# EAGLE design julia_v2 (EAGLE 9.6.2)

## Sheet 1 of 2
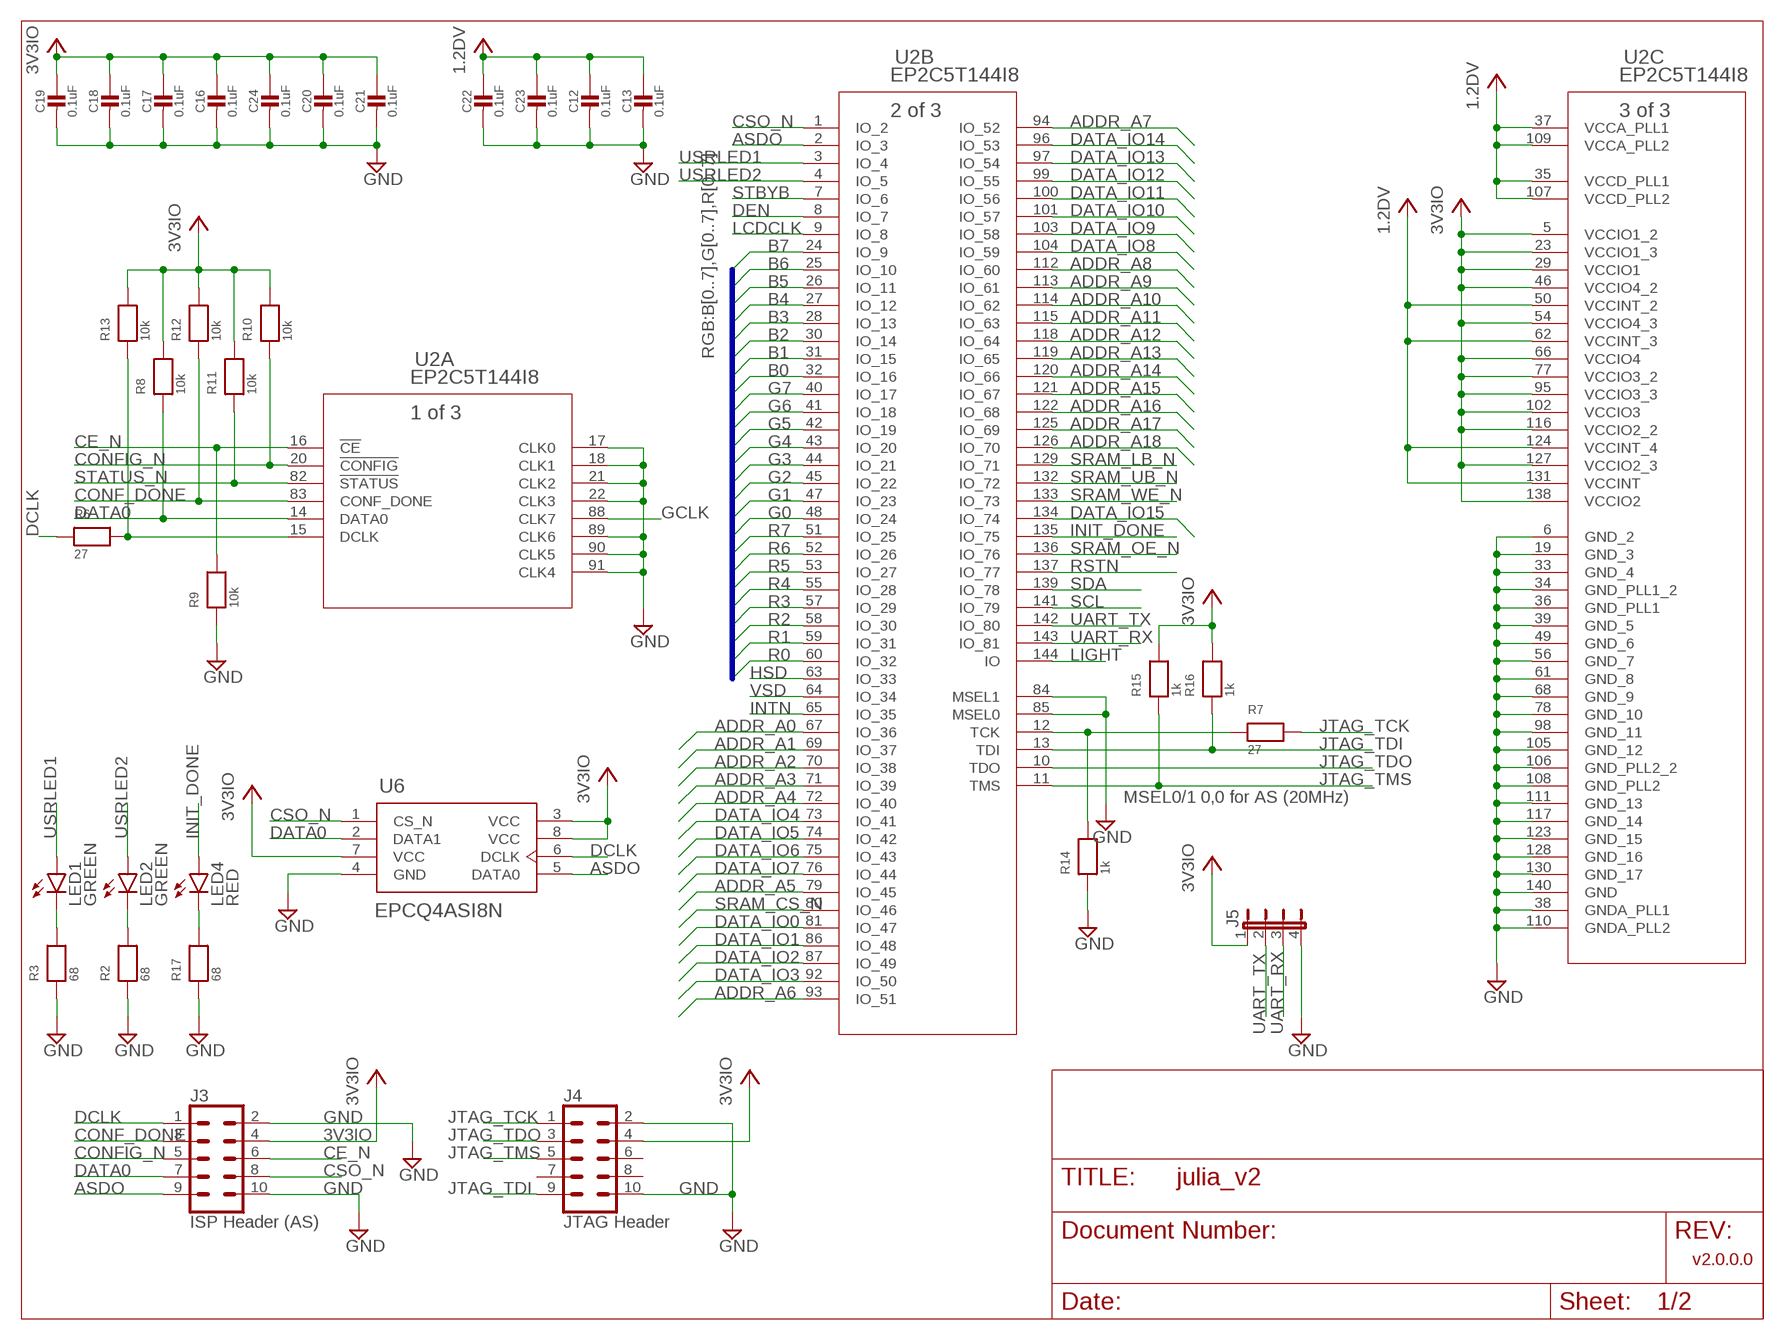
[diagram p0: schematic, sheet 1]

### Parts
C12  0.1uF  CAP_CERAMIC0805  [0805]
C13  0.1uF  CAP_CERAMIC0805  [0805]
C16  0.1uF  CAP_CERAMIC0805  [0805]
C17  0.1uF  CAP_CERAMIC0805  [0805]
C18  0.1uF  CAP_CERAMIC0805  [0805]
C19  0.1uF  CAP_CERAMIC0805  [0805]
C20  0.1uF  CAP_CERAMIC0805  [0805]
C21  0.1uF  CAP_CERAMIC0805  [0805]
C22  0.1uF  CAP_CERAMIC0805  [0805]
C23  0.1uF  CAP_CERAMIC0805  [0805]
C24  0.1uF  CAP_CERAMIC0805  [0805]
J3  ISP Header (AS)  CONN_05X2SHD  [2X5-SHROUDED]
J4  JTAG Header  CONN_05X2SHD  [2X5-SHROUDED]
J5  JP4E  [JP4]
LED1  GREEN  LEDCHIPLED_0805  [CHIPLED_0805]
LED2  GREEN  LEDCHIPLED_0805  [CHIPLED_0805]
LED4  RED  LEDCHIPLED_0805  [CHIPLED_0805]
R2  68  RESISTOR0805  [0805]
R3  68  RESISTOR0805  [0805]
R6  27  RESISTOR0805  [0805]
R7  27  RESISTOR0805  [0805]
R8  10k  RESISTOR0805  [0805]
R9  10k  RESISTOR0805  [0805]
R10  10k  RESISTOR0805  [0805]
R11  10k  RESISTOR0805  [0805]
R12  10k  RESISTOR0805  [0805]
R13  10k  RESISTOR0805  [0805]
R14  1k  RESISTOR0805  [0805]
R15  1k  RESISTOR0805  [0805]
R16  1k  RESISTOR0805  [0805]
R17  68  RESISTOR0805  [0805]
U2  EP2C5T144I8  [144-TQFP_ALR]
U6  EPCQ4ASI8N  [8SOIC]

### Nets
1.2DV: C12.1 C13.1 C22.1 C23.1 U2.35(C:VCCD_PLL1) U2.37(C:VCCA_PLL1) U2.50(C:VCCINT_2) U2.62(C:VCCINT_3) U2.107(C:VCCD_PLL2) U2.109(C:VCCA_PLL2) U2.124(C:VCCINT_4) U2.131(C:VCCINT) ; also sheet 2
3V3IO: C16.1 C17.1 C18.1 C19.1 C20.1 C21.1 C24.1 J3.4 J4.4 J5.1 R8.2 R10.2 R11.2 R12.2 R13.2 R15.2 R16.2 U2.5(C:VCCIO1_2) U2.23(C:VCCIO1_3) U2.29(C:VCCIO1) U2.46(C:VCCIO4_2) U2.54(C:VCCIO4_3) U2.66(C:VCCIO4) U2.77(C:VCCIO3_2) U2.95(C:VCCIO3_3) U2.102(C:VCCIO3) U2.116(C:VCCIO2_2) U2.127(C:VCCIO2_3) U2.138(C:VCCIO2) U6.3(VCC) U6.7(VCC) U6.8(VCC) ; also sheet 2
ADDR_A0: U2.67(B:IO_36) ; also sheet 2
ADDR_A1: U2.69(B:IO_37) ; also sheet 2
ADDR_A2: U2.70(B:IO_38) ; also sheet 2
ADDR_A3: U2.71(B:IO_39) ; also sheet 2
ADDR_A4: U2.72(B:IO_40) ; also sheet 2
ADDR_A5: U2.79(B:IO_45) ; also sheet 2
ADDR_A6: U2.93(B:IO_51) ; also sheet 2
ADDR_A7: U2.94(B:IO_52) ; also sheet 2
ADDR_A8: U2.112(B:IO_60) ; also sheet 2
ADDR_A9: U2.113(B:IO_61) ; also sheet 2
ADDR_A10: U2.114(B:IO_62) ; also sheet 2
ADDR_A11: U2.115(B:IO_63) ; also sheet 2
ADDR_A12: U2.118(B:IO_64) ; also sheet 2
ADDR_A13: U2.119(B:IO_65) ; also sheet 2
ADDR_A14: U2.120(B:IO_66) ; also sheet 2
ADDR_A15: U2.121(B:IO_67) ; also sheet 2
ADDR_A16: U2.122(B:IO_68) ; also sheet 2
ADDR_A17: U2.125(B:IO_69) ; also sheet 2
ADDR_A18: U2.126(B:IO_70) ; also sheet 2
ASDO: J3.9 U2.2(B:IO_3) U6.5(DATA0)
B0: U2.32(B:IO_16) ; also sheet 2
B1: U2.31(B:IO_15) ; also sheet 2
B2: U2.30(B:IO_14) ; also sheet 2
B3: U2.28(B:IO_13) ; also sheet 2
B4: U2.27(B:IO_12) ; also sheet 2
B5: U2.26(B:IO_11) ; also sheet 2
B6: U2.25(B:IO_10) ; also sheet 2
B7: U2.24(B:IO_9) ; also sheet 2
CE_N: J3.6 R9.2 U2.16(A:!CE)
CONF_DONE: J3.3 R12.1 U2.83(A:CONF_DONE)
CONFIG_N: J3.5 R10.1 U2.20(A:!CONFIG)
CSO_N: J3.8 U2.1(B:IO_2) U6.1(CS_N)
DATA0: J3.7 R8.1 U2.14(A:DATA0) U6.2(DATA1)
DATA_IO0: U2.81(B:IO_47) ; also sheet 2
DATA_IO1: U2.86(B:IO_48) ; also sheet 2
DATA_IO2: U2.87(B:IO_49) ; also sheet 2
DATA_IO3: U2.92(B:IO_50) ; also sheet 2
DATA_IO4: U2.73(B:IO_41) ; also sheet 2
DATA_IO5: U2.74(B:IO_42) ; also sheet 2
DATA_IO6: U2.75(B:IO_43) ; also sheet 2
DATA_IO7: U2.76(B:IO_44) ; also sheet 2
DATA_IO8: U2.104(B:IO_59) ; also sheet 2
DATA_IO9: U2.103(B:IO_58) ; also sheet 2
DATA_IO10: U2.101(B:IO_57) ; also sheet 2
DATA_IO11: U2.100(B:IO_56) ; also sheet 2
DATA_IO12: U2.99(B:IO_55) ; also sheet 2
DATA_IO13: U2.97(B:IO_54) ; also sheet 2
DATA_IO14: U2.96(B:IO_53) ; also sheet 2
DATA_IO15: U2.134(B:IO_74) ; also sheet 2
DCLK: J3.1 R6.1 U6.6(DCLK)
DEN: U2.8(B:IO_7) ; also sheet 2
G0: U2.48(B:IO_24) ; also sheet 2
G1: U2.47(B:IO_23) ; also sheet 2
G2: U2.45(B:IO_22) ; also sheet 2
G3: U2.44(B:IO_21) ; also sheet 2
G4: U2.43(B:IO_20) ; also sheet 2
G5: U2.42(B:IO_19) ; also sheet 2
G6: U2.41(B:IO_18) ; also sheet 2
G7: U2.40(B:IO_17) ; also sheet 2
GCLK: U2.88(A:CLK7) ; also sheet 2
GND: C12.2 C13.2 C16.2 C17.2 C18.2 C19.2 C20.2 C21.2 C22.2 C23.2 C24.2 J3.2 J3.10 J4.2 J4.10 J5.4 R2.1 R3.1 R9.1 R14.1 R17.1 U2.6(C:GND_2) U2.17(A:CLK0) U2.18(A:CLK1) U2.19(C:GND_3) U2.21(A:CLK2) U2.22(A:CLK3) U2.33(C:GND_4) U2.34(C:GND_PLL1_2) U2.36(C:GND_PLL1) U2.38(C:GNDA_PLL1) U2.39(C:GND_5) U2.49(C:GND_6) U2.56(C:GND_7) U2.61(C:GND_8) U2.68(C:GND_9) U2.78(C:GND_10) U2.84(B:MSEL1) U2.85(B:MSEL0) U2.89(A:CLK6) U2.90(A:CLK5) U2.91(A:CLK4) U2.98(C:GND_11) U2.105(C:GND_12) U2.106(C:GND_PLL2_2) U2.108(C:GND_PLL2) U2.110(C:GNDA_PLL2) U2.111(C:GND_13) U2.117(C:GND_14) U2.123(C:GND_15) U2.128(C:GND_16) U2.130(C:GND_17) U2.140(C:GND) U6.4(GND) ; also sheet 2
HSD: U2.63(B:IO_33) ; also sheet 2
INIT_DONE: LED4.A U2.135(B:IO_75)
INTN: U2.65(B:IO_35) ; also sheet 2
JTAG_TCK: J4.1 R7.2
JTAG_TDI: J4.9 R16.1 U2.13(B:TDI)
JTAG_TDO: J4.3 U2.10(B:TDO)
JTAG_TMS: J4.5 R15.1 U2.11(B:TMS)
LCDCLK: U2.9(B:IO_8) ; also sheet 2
LIGHT: U2.144(B:IO) ; also sheet 2
N$7: R6.2 R13.1 U2.15(A:DCLK)
N$9: LED1.C R3.2
N$10: R7.1 R14.2 U2.12(B:TCK)
N$12: LED4.C R17.2
N$13: LED2.C R2.2
R0: U2.60(B:IO_32) ; also sheet 2
R1: U2.59(B:IO_31) ; also sheet 2
R2: U2.58(B:IO_30) ; also sheet 2
R3: U2.57(B:IO_29) ; also sheet 2
R4: U2.55(B:IO_28) ; also sheet 2
R5: U2.53(B:IO_27) ; also sheet 2
R6: U2.52(B:IO_26) ; also sheet 2
R7: U2.51(B:IO_25) ; also sheet 2
RSTN: U2.137(B:IO_77) ; also sheet 2
SCL: U2.141(B:IO_79) ; also sheet 2
SDA: U2.139(B:IO_78) ; also sheet 2
SRAM_CS_N: U2.80(B:IO_46) ; also sheet 2
SRAM_LB_N: U2.129(B:IO_71) ; also sheet 2
SRAM_OE_N: U2.136(B:IO_76) ; also sheet 2
SRAM_UB_N: U2.132(B:IO_72) ; also sheet 2
SRAM_WE_N: U2.133(B:IO_73) ; also sheet 2
STATUS_N: R11.1 U2.82(A:!STATUS) ; also sheet 2
STBYB: U2.7(B:IO_6) ; also sheet 2
UART_RX: J5.3 U2.143(B:IO_81)
UART_TX: J5.2 U2.142(B:IO_80)
USRLED1: LED1.A U2.3(B:IO_4)
USRLED2: LED2.A U2.4(B:IO_5)
VSD: U2.64(B:IO_34) ; also sheet 2
Unconnected: J4.6 J4.7 J4.8

### Buses
RGB:B[0..7],G[0..7],R[0..7]

### Notes on the sheet
- MSEL0/1 0,0 for AS (20MHz)
- v2.0.0.0

## Sheet 2 of 2
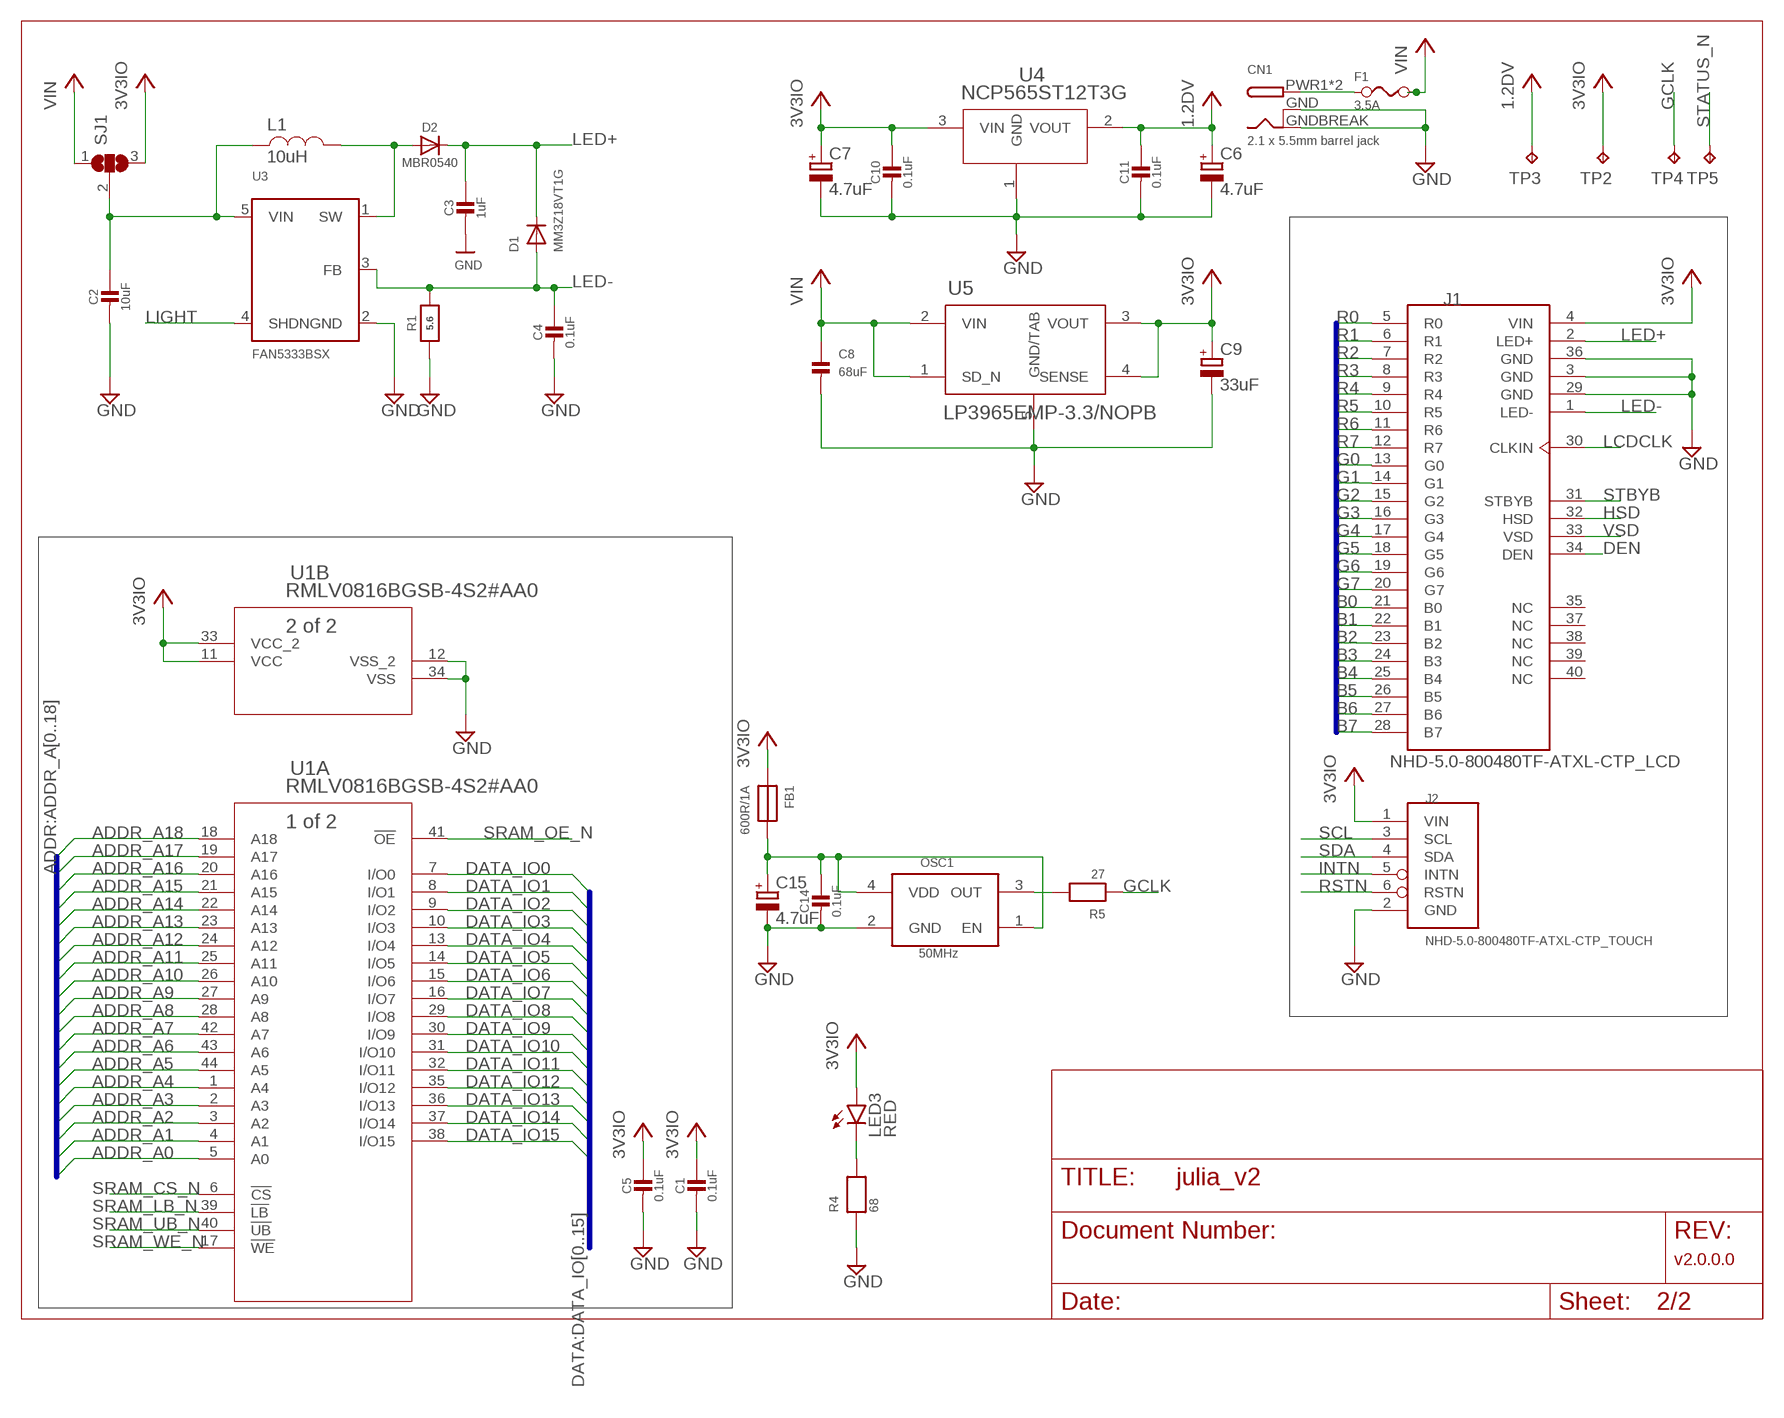
[diagram p1: schematic, sheet 2]

### Parts
C1  0.1uF  CAP_CERAMIC0805  [0805]
C2  10uF  CAP_CERAMIC0805  [0805]
C3  1uF  CAP_CERAMIC0805  [0805]
C4  0.1uF  CAP_CERAMIC0805  [0805]
C5  0.1uF  CAP_CERAMIC0805  [0805]
C6  4.7uF  CPOL  [CPOL0805]
C7  4.7uF  CPOL  [CPOL0805]
C8  68uF  CAP_CERAMIC1206  [1206]
C9  33uF  CPOL  [CPOL0805]
C10  0.1uF  CAP_CERAMIC0805  [0805]
C11  0.1uF  CAP_CERAMIC0805  [0805]
C14  0.1uF  CAP_CERAMIC0805  [0805]
C15  4.7uF  CPOL  [CPOL0805]
CN1  DCBARRELSMT  [DCJACK_2MM_SMT]
D1  MM3Z18VT1G  DIODE-SOD323  [SOD-323]
D2  MBR0540  DIODESOD-123  [SOD-123]
F1  3.5A  FUSE12061206  [1206]
FB1  600R/1A  FERRITE  [0603]
J1  NHD-5.0-800480TF-ATXL-CTP_LCD  [54132-4097]
J2  NHD-5.0-800480TF-ATXL-CTP_TOUCH  [52271-0679]
L1  10uH  SPM10040T-100M-HZ  [SPM10040T-100M-HZ]
LED3  RED  LEDCHIPLED_0805  [CHIPLED_0805]
OSC1  50MHz  ASV-50.000MHZ-EJ-T  [CRYSTALASV]
R1  5.6  RESISTOR0805  [0805]
R4  68  RESISTOR0805  [0805]
R5  27  RESISTOR0805  [0805]
SJ1  SJ2WW  [SJ_2W]
TP2  TPB1,27  [B1,27]
TP3  TPB1,27  [B1,27]
TP4  TPB1,27  [B1,27]
TP5  TPB1,27  [B1,27]
U1  RMLV0816BGSB-4S2#AA0  [PTSB0044GG-A_REN]
U3  FAN5333BSX  FAN5331  [SOT23-5@1]
U4  NCP565ST12T3G  [SOT223-3_ONS]
U5  LP3965EMP-3.3/NOPB  [NDC0005A]

### Nets
1.2DV: C6.1(+) C11.1 TP3.TP U4.2(VOUT) ; also sheet 1
3V3IO: C1.1 C5.1 C7.1(+) C9.1(+) C10.1 FB1.1 J1.4(VIN) J2.1(VIN) LED3.A SJ1.3 TP2.TP U1.11(B:VCC) U1.33(B:VCC_2) U4.3(VIN) U5.3(VOUT) U5.4(SENSE) ; also sheet 1
_GCLK: OSC1.3(OUT) R5.2
ADDR_A0: U1.5(A:A0) ; also sheet 1
ADDR_A1: U1.4(A:A1) ; also sheet 1
ADDR_A2: U1.3(A:A2) ; also sheet 1
ADDR_A3: U1.2(A:A3) ; also sheet 1
ADDR_A4: U1.1(A:A4) ; also sheet 1
ADDR_A5: U1.44(A:A5) ; also sheet 1
ADDR_A6: U1.43(A:A6) ; also sheet 1
ADDR_A7: U1.42(A:A7) ; also sheet 1
ADDR_A8: U1.28(A:A8) ; also sheet 1
ADDR_A9: U1.27(A:A9) ; also sheet 1
ADDR_A10: U1.26(A:A10) ; also sheet 1
ADDR_A11: U1.25(A:A11) ; also sheet 1
ADDR_A12: U1.24(A:A12) ; also sheet 1
ADDR_A13: U1.23(A:A13) ; also sheet 1
ADDR_A14: U1.22(A:A14) ; also sheet 1
ADDR_A15: U1.21(A:A15) ; also sheet 1
ADDR_A16: U1.20(A:A16) ; also sheet 1
ADDR_A17: U1.19(A:A17) ; also sheet 1
ADDR_A18: U1.18(A:A18) ; also sheet 1
B0: J1.21(B0) ; also sheet 1
B1: J1.22(B1) ; also sheet 1
B2: J1.23(B2) ; also sheet 1
B3: J1.24(B3) ; also sheet 1
B4: J1.25(B4) ; also sheet 1
B5: J1.26(B5) ; also sheet 1
B6: J1.27(B6) ; also sheet 1
B7: J1.28(B7) ; also sheet 1
DATA_IO0: U1.7(A:I/O0) ; also sheet 1
DATA_IO1: U1.8(A:I/O1) ; also sheet 1
DATA_IO2: U1.9(A:I/O2) ; also sheet 1
DATA_IO3: U1.10(A:I/O3) ; also sheet 1
DATA_IO4: U1.13(A:I/O4) ; also sheet 1
DATA_IO5: U1.14(A:I/O5) ; also sheet 1
DATA_IO6: U1.15(A:I/O6) ; also sheet 1
DATA_IO7: U1.16(A:I/O7) ; also sheet 1
DATA_IO8: U1.29(A:I/O8) ; also sheet 1
DATA_IO9: U1.30(A:I/O9) ; also sheet 1
DATA_IO10: U1.31(A:I/O10) ; also sheet 1
DATA_IO11: U1.32(A:I/O11) ; also sheet 1
DATA_IO12: U1.35(A:I/O12) ; also sheet 1
DATA_IO13: U1.36(A:I/O13) ; also sheet 1
DATA_IO14: U1.37(A:I/O14) ; also sheet 1
DATA_IO15: U1.38(A:I/O15) ; also sheet 1
DEN: J1.34(DEN) ; also sheet 1
F_SW: D2.A L1.1 U3.1(SW)
F_VIN: C2.1 L1.2 SJ1.2 U3.5(VIN)
G0: J1.13(G0) ; also sheet 1
G1: J1.14(G1) ; also sheet 1
G2: J1.15(G2) ; also sheet 1
G3: J1.16(G3) ; also sheet 1
G4: J1.17(G4) ; also sheet 1
G5: J1.18(G5) ; also sheet 1
G6: J1.19(G6) ; also sheet 1
G7: J1.20(G7) ; also sheet 1
GCLK: R5.1 TP4.TP ; also sheet 1
GND: C1.2 C2.2 C3.2 C4.2 C5.2 C6.2(-) C7.2(-) C8.2 C9.2(-) C10.2 C11.2 C14.2 C15.2(-) CN1.GND CN1.GNDBREAK J1.3(GND) J1.29(GND) J1.36(GND) J2.2(GND) OSC1.2(GND) R1.1 R4.1 U1.12(B:VSS_2) U1.34(B:VSS) U3.2(GND) U4.1(GND) U5.5(GND/TAB) ; also sheet 1
HSD: J1.32(HSD) ; also sheet 1
INTN: J2.5(INTN) ; also sheet 1
LCDCLK: J1.30(CLKIN) ; also sheet 1
LED+: C3.1 D1.1(C) D2.C J1.2(LED+)
LED-: C4.1 D1.2(A) J1.1(LED-) R1.2 U3.3(FB)
LIGHT: U3.4(SHDN) ; also sheet 1
N$1: CN1.PWR1(PWR) CN1.PWR2(PWR) F1.1
N$6: LED3.C R4.2
OSC_V: C14.1 C15.1(+) FB1.2 OSC1.1(EN) OSC1.4(VDD)
R0: J1.5(R0) ; also sheet 1
R1: J1.6(R1) ; also sheet 1
R2: J1.7(R2) ; also sheet 1
R3: J1.8(R3) ; also sheet 1
R4: J1.9(R4) ; also sheet 1
R5: J1.10(R5) ; also sheet 1
R6: J1.11(R6) ; also sheet 1
R7: J1.12(R7) ; also sheet 1
RSTN: J2.6(RSTN) ; also sheet 1
SCL: J2.3(SCL) ; also sheet 1
SDA: J2.4(SDA) ; also sheet 1
SRAM_CS_N: U1.6(A:!CS) ; also sheet 1
SRAM_LB_N: U1.39(A:!LB) ; also sheet 1
SRAM_OE_N: U1.41(A:!OE) ; also sheet 1
SRAM_UB_N: U1.40(A:!UB) ; also sheet 1
SRAM_WE_N: U1.17(A:!WE) ; also sheet 1
STATUS_N: TP5.TP ; also sheet 1
STBYB: J1.31(STBYB) ; also sheet 1
VIN: C8.1 F1.2 SJ1.1 U5.1(SD_N) U5.2(VIN)
VSD: J1.33(VSD) ; also sheet 1
Unconnected: J1.35(NC) J1.37(NC) J1.38(NC) J1.39(NC) J1.40(NC)

### Buses
DATA:DATA_IO[0..15]
RGB:B[0..7],G[0..7],R[0..7]
ADDR:ADDR_A[0..18]

### Notes on the sheet
- 2.1 x 5.5mm barrel jack
- v2.0.0.0

## Library data of the parts
C1 C4 C5 C10-C14 C16-C24 = microbuilder:CAP_CERAMIC: Ceramic Capacitors 0402 - 0402 Surface Mount Capacitors 0.1uF 10V 10% [Digikey: 490-1318-2-ND] 0603 - 0603 Surface Mount Capacitors 16 pF 50V 5% [Digikey: 445-5051-2-ND] 22 pF 50V [Digikey: PCC220ACVTR-ND] 33 pF 50V 5% [Digikey: 490-1415-1-ND] 56pF 50V 5% [Digikey: 490-1421-1-ND] 220pF 50V 5% [Digikey: 445-1285-1-ND] 680 pF 50V 2200 pF 50V 5% C0G [Digikey: 445-1297-1-ND] 5600 pF 100V 5% X7R [Digikey: 478-3711-1-ND] 0.1 µF 25V 10% [Digikey: PCC2277TR-ND] 0.22 µF 16V 10% X7R [Digikey: 445-1318-1-ND] 1.0 µF 25V 10% [Digikey: 445-5146-2-ND] 0603 - RF Specific 3pF 250V +/-0.1pF RF [Digikey: 712-1347-1-ND] 18 pF 250V 5% [Digikey: 478-3505-1-ND or 712-1322-1-ND] 56 pF 250V 5% C0G RF [Digikey: 490-4867-1-ND] 68 pF 250V RF [Digikey: 490-4868-1-ND] 0805 - 0805 Surface Mount Capacitors 220 pF 250V 2% RF Ceramic Capacitor [Digikey: 712-1398-1-ND] 1000 pF 50V 2% NP0 Ceramic Capacitor [Digikey: 478-3760-1-ND] 0.1 µF 25V 10% Ceramic Capacitor [Digikey: PCC1828TR-ND] 1.0 µF 16V 10% Ceramic Capacitor[Digikey: 490-1691-2-ND] 10.0 µF 10V 10% Ceramic Capacitor[Digikey: 709-1228-1-ND] 1206 - 1206 Surface Mount Capacitors; DPN: 478-12799-1-ND; MPN: 0805ZD104KAT2A
C2 = microbuilder:CAP_CERAMIC: Ceramic Capacitors 0402 - 0402 Surface Mount Capacitors 0.1uF 10V 10% [Digikey: 490-1318-2-ND] 0603 - 0603 Surface Mount Capacitors 16 pF 50V 5% [Digikey: 445-5051-2-ND] 22 pF 50V [Digikey: PCC220ACVTR-ND] 33 pF 50V 5% [Digikey: 490-1415-1-ND] 56pF 50V 5% [Digikey: 490-1421-1-ND] 220pF 50V 5% [Digikey: 445-1285-1-ND] 680 pF 50V 2200 pF 50V 5% C0G [Digikey: 445-1297-1-ND] 5600 pF 100V 5% X7R [Digikey: 478-3711-1-ND] 0.1 µF 25V 10% [Digikey: PCC2277TR-ND] 0.22 µF 16V 10% X7R [Digikey: 445-1318-1-ND] 1.0 µF 25V 10% [Digikey: 445-5146-2-ND] 0603 - RF Specific 3pF 250V +/-0.1pF RF [Digikey: 712-1347-1-ND] 18 pF 250V 5% [Digikey: 478-3505-1-ND or 712-1322-1-ND] 56 pF 250V 5% C0G RF [Digikey: 490-4867-1-ND] 68 pF 250V RF [Digikey: 490-4868-1-ND] 0805 - 0805 Surface Mount Capacitors 220 pF 250V 2% RF Ceramic Capacitor [Digikey: 712-1398-1-ND] 1000 pF 50V 2% NP0 Ceramic Capacitor [Digikey: 478-3760-1-ND] 0.1 µF 25V 10% Ceramic Capacitor [Digikey: PCC1828TR-ND] 1.0 µF 16V 10% Ceramic Capacitor[Digikey: 490-1691-2-ND] 10.0 µF 10V 10% Ceramic Capacitor[Digikey: 709-1228-1-ND] 1206 - 1206 Surface Mount Capacitors; DPN: 1276-6456-1-ND; MPN: CL21A106KPFNNNG
C3 = microbuilder:CAP_CERAMIC: Ceramic Capacitors 0402 - 0402 Surface Mount Capacitors 0.1uF 10V 10% [Digikey: 490-1318-2-ND] 0603 - 0603 Surface Mount Capacitors 16 pF 50V 5% [Digikey: 445-5051-2-ND] 22 pF 50V [Digikey: PCC220ACVTR-ND] 33 pF 50V 5% [Digikey: 490-1415-1-ND] 56pF 50V 5% [Digikey: 490-1421-1-ND] 220pF 50V 5% [Digikey: 445-1285-1-ND] 680 pF 50V 2200 pF 50V 5% C0G [Digikey: 445-1297-1-ND] 5600 pF 100V 5% X7R [Digikey: 478-3711-1-ND] 0.1 µF 25V 10% [Digikey: PCC2277TR-ND] 0.22 µF 16V 10% X7R [Digikey: 445-1318-1-ND] 1.0 µF 25V 10% [Digikey: 445-5146-2-ND] 0603 - RF Specific 3pF 250V +/-0.1pF RF [Digikey: 712-1347-1-ND] 18 pF 250V 5% [Digikey: 478-3505-1-ND or 712-1322-1-ND] 56 pF 250V 5% C0G RF [Digikey: 490-4867-1-ND] 68 pF 250V RF [Digikey: 490-4868-1-ND] 0805 - 0805 Surface Mount Capacitors 220 pF 250V 2% RF Ceramic Capacitor [Digikey: 712-1398-1-ND] 1000 pF 50V 2% NP0 Ceramic Capacitor [Digikey: 478-3760-1-ND] 0.1 µF 25V 10% Ceramic Capacitor [Digikey: PCC1828TR-ND] 1.0 µF 16V 10% Ceramic Capacitor[Digikey: 490-1691-2-ND] 10.0 µF 10V 10% Ceramic Capacitor[Digikey: 709-1228-1-ND] 1206 - 1206 Surface Mount Capacitors; DPN: 1276-2395-1-ND; MPN: CL21A105KACLNNC
C6 C7 C15 = ik:CPOL; DPN: 478-8120-1-ND; MPN: F920J475MPA
C8 = microbuilder:CAP_CERAMIC: Ceramic Capacitors 0402 - 0402 Surface Mount Capacitors 0.1uF 10V 10% [Digikey: 490-1318-2-ND] 0603 - 0603 Surface Mount Capacitors 16 pF 50V 5% [Digikey: 445-5051-2-ND] 22 pF 50V [Digikey: PCC220ACVTR-ND] 33 pF 50V 5% [Digikey: 490-1415-1-ND] 56pF 50V 5% [Digikey: 490-1421-1-ND] 220pF 50V 5% [Digikey: 445-1285-1-ND] 680 pF 50V 2200 pF 50V 5% C0G [Digikey: 445-1297-1-ND] 5600 pF 100V 5% X7R [Digikey: 478-3711-1-ND] 0.1 µF 25V 10% [Digikey: PCC2277TR-ND] 0.22 µF 16V 10% X7R [Digikey: 445-1318-1-ND] 1.0 µF 25V 10% [Digikey: 445-5146-2-ND] 0603 - RF Specific 3pF 250V +/-0.1pF RF [Digikey: 712-1347-1-ND] 18 pF 250V 5% [Digikey: 478-3505-1-ND or 712-1322-1-ND] 56 pF 250V 5% C0G RF [Digikey: 490-4867-1-ND] 68 pF 250V RF [Digikey: 490-4868-1-ND] 0805 - 0805 Surface Mount Capacitors 220 pF 250V 2% RF Ceramic Capacitor [Digikey: 712-1398-1-ND] 1000 pF 50V 2% NP0 Ceramic Capacitor [Digikey: 478-3760-1-ND] 0.1 µF 25V 10% Ceramic Capacitor [Digikey: PCC1828TR-ND] 1.0 µF 16V 10% Ceramic Capacitor[Digikey: 490-1691-2-ND] 10.0 µF 10V 10% Ceramic Capacitor[Digikey: 709-1228-1-ND] 1206 - 1206 Surface Mount Capacitors; DPN: 445-14673-1-ND; MPN: C3216X5R1A686M160AC
C9 = ik:CPOL; DPN: 478-5350-1-ND; MPN: TLJP336M010R3500
CN1 = ik:DCBARREL: 2.0mm DC Barrel Jack DCJACK_2MM_PTH - Through Hole Jack (4UConnector: 05537) DCJACK_2MM_SMT - SMT Version (4UConnector: 03267); DPN: 2073-DCJ200-05-A-K1-ACT-ND; MPN: DCJ200-05-A-K1-A
D1 = ik:DIODE-SOD323; DPN: MM3Z18VT1GOSCT-ND; MPN: MM3Z18VT1G
D2 = microbuilder:DIODE: Diode SMA Model Volts Amps Type Vf Ir Digikey # Notes SSA34-E3 40V 3A Schottky 480mV @ 3A 200uA @ 40V SSA34-E3/61TGITR-ND CDBA120-G 20V 1A Schottky 500mV @ 1A 500uA @ 20V 641-1014-6-ND REEL MBRA210 10V 2A Schottky 350mV @ 2A 700uA @ 10V MBRA210LT3 SOD-123 Model Volts Amps Type Vf Ir Order # Notes BAT54T1G 30V 200mA Schottky 800mV @ 200mA 2uA @ 25V BAT54T1GOSTR-ND B0530W 30V 500mA Schottky 430mV @ 500mA 130uA @ 30V B0530W-FDICT-ND REEL MBR120 20V 1A Schottky 340mV @ 1A MBR120VLSFT1GOSCT-ND SOD-323 Model Volts Amps Type Vf Ir Order # Notes PMEG2005EJ 20V 500mA Schottky 355mV @ 500mA 568-4110-1-ND ZLLS410 10V 570mA Schottky 380mV @ 570mA ZLLS410CT-ND 1N4148WS 75V 150mA Silicon/Simple 1V 1N4148WSFSCT-ND REEL SOD-523 Model Volts Amps Type Vf Ir Order # Notes BAT54XV2 30V 200mA Schottky 0.8V @ 100mA BAT54XV2CT-ND TB751S 30V 30mA Schottky RB751S-40TE61CT-ND SOT23-R/W (R = Solder Paste/Reflow Ovens, W = Hand-Soldering) Model Volts Amps Type Vf Ir Order # Notes BAT54FILM 40V 300mA Schottky 497-7162-1-ND POWERDI-5 Model Volts Amps Type Vf Ir Order # Notes PDS560 60V 5A Schottky 670mV @ 5A 150uA @ 60V PDS560DICT-ND; DPN: MBR0540CT-ND; MPN: MBR0540
F1 = ik:FUSE1206; DPN: 507-1884-1-ND; MPN: C1F 3.5
FB1 = microbuilder:FERRITE: Ferrite Bead 0603 120 Ohm, 600mA Ferrite Chip - Digikey: 445-2164-1-ND; DPN: 240-2371-1-ND; MPN: MI0603J601R-10
J1 = ik:NHD-5.0-800480TF-ATXL-CTP_LCD; DPN: WM3431CT-ND; MPN: 54104-4031
J2 = ik:NHD-5.0-800480TF-ATXL-CTP_TOUCH; DPN: WM7955CT-ND; MPN: 52271-0679
J3 J4 = fab:CONN_05X2: Multi connection point. Often used as Generic Header-pin footprint for 0.1 inch spaced/style header connections For AVR SPI programming port, see special device with nice symbol: "AVR_SPI_PROG_5x2.dev" You can populate with any combo of single row headers, but if you'd like an exact match, check these: 2x5 AVR ICSP Male Header <https://www.sparkfun.com/products/778> (PRT-00778) 2x5 Pin Shrouded Header <https://www.sparkfun.com/products/8506> (PRT-08506) On any of the 0.1 inch spaced packages, you can populate with these: Break Away Headers - Straight <https://www.sparkfun.com/products/116> (PRT-00116) Break Away Male Headers - Right Angle <https://www.sparkfun.com/products/553> (PRT-00553) Female Headers <https://www.sparkfun.com/products/115> (PRT-00115) Break Away Headers - Machine Pin <https://www.sparkfun.com/products/117> (PRT-00117) Break Away Female Headers - Swiss Machine Pin <https://www.sparkfun.com/products/743> (PRT-00743) Special note: the shrouded connector mates well with our 5x2 ribbon cables: 2x5 Pin IDC Ribbon Cable <https://www.sparkfun.com/products/8535> (PRT-08535); DPN: S9169-ND; MPN: SBH11-PBPC-D05-ST-BK; PROD_ID: CONN-08671; SF_ID: PRT-08506
J5 = jumper:JP4E: JUMPER
L1 = ik:SPM10040T-100M-HZ; DPN: 445-180240-1-ND; MPN: SPM10040T-100M-HZ
LED1 LED2 = led:LED: LED OSRAM: - CHIPLED LG R971, LG N971, LY N971, LG Q971, LY Q971, LO R971, LY R971 LH N974, LH R974 LS Q976, LO Q976, LY Q976 LO Q996 - Hyper CHIPLED LW Q18S LB Q993, LB Q99A, LB R99A - SideLED LS A670, LO A670, LY A670, LG A670, LP A670 LB A673, LV A673, LT A673, LW A673 LH A674 LY A675 LS A676, LA A676, LO A676, LY A676, LW A676 LS A679, LY A679, LG A679 - Hyper Micro SIDELED® LS Y876, LA Y876, LO Y876, LY Y876 LT Y87S - SmartLED LW L88C, LW L88S LB L89C, LB L89S, LG L890 LS L89K, LO L89K, LY L89K LS L896, LA L896, LO L896, LY L896 - TOPLED LS T670, LO T670, LY T670, LG T670, LP T670 LSG T670, LSP T670, LSY T670, LOP T670, LYG T670 LG T671, LOG T671, LSG T671 LB T673, LV T673, LT T673, LW T673 LH T674 LS T676, LA T676, LO T676, LY T676, LB T676, LH T676, LSB T676, LW T676 LB T67C, LV T67C, LT T67C, LS T67K, LO T67K, LY T67K, LW E67C LS E67B, LA E67B, LO E67B, LY E67B, LB E67C, LV E67C, LT E67C LW T67C LS T679, LY T679, LG T679 LS T770, LO T770, LY T770, LG T770, LP T770 LB T773, LV T773, LT T773, LW T773 LH T774 LS E675, LA E675, LY E675, LS T675 LS T776, LA T776, LO T776, LY T776, LB T776 LHGB T686 LT T68C, LB T68C - Hyper Mini TOPLED® LB M676 - Mini TOPLED Santana® LG M470 LS M47K, LO M47K, LY M47K Source: http://www.osram.convergy.de LUXEON: - LUMILED® LXK2-PW12-R00, LXK2-PW12-S00, LXK2-PW14-U00, LXK2-PW14-V00 LXK2-PM12-R00, LXK2-PM12-S00, LXK2-PM14-U00 LXK2-PE12-Q00, LXK2-PE12-R00, LXK2-PE12-S00, LXK2-PE14-T00, LXK2-PE14-U00 LXK2-PB12-K00, LXK2-PB12-L00, LXK2-PB12-M00, LXK2-PB14-N00, LXK2-PB14-P00, LXK2-PB14-Q00 LXK2-PR12-L00, LXK2-PR12-M00, LXK2-PR14-Q00, LXK2-PR14-R00 LXK2-PD12-Q00, LXK2-PD12-R00, LXK2-PD12-S00 LXK2-PH12-R00, LXK2-PH12-S00 LXK2-PL12-P00, LXK2-PL12-Q00, LXK2-PL12-R00 Source: www.luxeon.com KINGBRIGHT: KA-3528ASYC Source: www.kingbright.com; DPN: 67-1553-1-ND; MPN: ML-LXT0805IW-TR
LED3 LED4 = led:LED: LED OSRAM: - CHIPLED LG R971, LG N971, LY N971, LG Q971, LY Q971, LO R971, LY R971 LH N974, LH R974 LS Q976, LO Q976, LY Q976 LO Q996 - Hyper CHIPLED LW Q18S LB Q993, LB Q99A, LB R99A - SideLED LS A670, LO A670, LY A670, LG A670, LP A670 LB A673, LV A673, LT A673, LW A673 LH A674 LY A675 LS A676, LA A676, LO A676, LY A676, LW A676 LS A679, LY A679, LG A679 - Hyper Micro SIDELED® LS Y876, LA Y876, LO Y876, LY Y876 LT Y87S - SmartLED LW L88C, LW L88S LB L89C, LB L89S, LG L890 LS L89K, LO L89K, LY L89K LS L896, LA L896, LO L896, LY L896 - TOPLED LS T670, LO T670, LY T670, LG T670, LP T670 LSG T670, LSP T670, LSY T670, LOP T670, LYG T670 LG T671, LOG T671, LSG T671 LB T673, LV T673, LT T673, LW T673 LH T674 LS T676, LA T676, LO T676, LY T676, LB T676, LH T676, LSB T676, LW T676 LB T67C, LV T67C, LT T67C, LS T67K, LO T67K, LY T67K, LW E67C LS E67B, LA E67B, LO E67B, LY E67B, LB E67C, LV E67C, LT E67C LW T67C LS T679, LY T679, LG T679 LS T770, LO T770, LY T770, LG T770, LP T770 LB T773, LV T773, LT T773, LW T773 LH T774 LS E675, LA E675, LY E675, LS T675 LS T776, LA T776, LO T776, LY T776, LB T776 LHGB T686 LT T68C, LB T68C - Hyper Mini TOPLED® LB M676 - Mini TOPLED Santana® LG M470 LS M47K, LO M47K, LY M47K Source: http://www.osram.convergy.de LUXEON: - LUMILED® LXK2-PW12-R00, LXK2-PW12-S00, LXK2-PW14-U00, LXK2-PW14-V00 LXK2-PM12-R00, LXK2-PM12-S00, LXK2-PM14-U00 LXK2-PE12-Q00, LXK2-PE12-R00, LXK2-PE12-S00, LXK2-PE14-T00, LXK2-PE14-U00 LXK2-PB12-K00, LXK2-PB12-L00, LXK2-PB12-M00, LXK2-PB14-N00, LXK2-PB14-P00, LXK2-PB14-Q00 LXK2-PR12-L00, LXK2-PR12-M00, LXK2-PR14-Q00, LXK2-PR14-R00 LXK2-PD12-Q00, LXK2-PD12-R00, LXK2-PD12-S00 LXK2-PH12-R00, LXK2-PH12-S00 LXK2-PL12-P00, LXK2-PL12-Q00, LXK2-PL12-R00 Source: www.luxeon.com KINGBRIGHT: KA-3528ASYC Source: www.kingbright.com; DPN: 67-1552-1-ND; MPN: SML-LXT0805IW-TR
OSC1 = ik:ASV-50.000MHZ-EJ-T: 306010055; DPN: 535-9330-1-ND; MPN: ASV-50.000MHZ-EJ-T
R1 = microbuilder:RESISTOR: Resistors 0402 - 0402 Surface Mount Package 10.0K 1% 1/16W [Digikey: 311-10.0KLRTR-ND] 0603 - 0603 Surface Mount Package 0 Ohm 1/10 Watt 1% Resistor 15 Ohm 1/10 Watt 1% Resistor 33 Ohm 1/10 Watt 1% Resistor 49.9 Ohm 1/10 Watt 1% Resistor 100 Ohm 1/10 Watt 1% Resistor 150 Ohm 1/10 Watt 1% Resistor 240 Ohm 1/10 Watt 1% Resistor 390 Ohm 1/10 Watt 1% Resistor 560 Ohm 1/10 Watt 1% Resistor 750 Ohm 1/10 Watt 1% Resistor 1.0K Ohm 1/10 Watt 1% Resistor 1.5K Ohm 1/10 Watt 1% Resistor 2.0K Ohm 1/10 Watt 1% Resistor 4.7K Ohm 1/10 Watt 1% Resistor 10.0K Ohm 1/10 Watt 1% Resistor 20.0K Ohm 1/10 Watt 1% Resistor 33.0K Ohm 1/10 Watt 1% Resistor 100.0K Ohm 1/10 Watt 1% Resistor 0805 - 0805 Surface Mount Package 0 Ohm 1/8 Watt 1% Resistor 33 Ohm 1/8 Watt 1% Resistor 100 Ohm 1/8 Watt 1% Resistor 150 Ohm 1/8 Watt 1% Resistor 200 Ohm 1/8 Watt 1% Resistor 240 Ohm 1/8 Watt 1% Resistor 330 Ohm 1/8 Watt 1% Resistor 390 Ohm 1/8 Watt 1% Resistor 470 Ohm 1/8 Watt 1% Resistor 1.0K Ohm 1/8 Watt 1% Resistor 1.5K Ohm 1/8 Watt 1% Resistor 2.0K Ohm 1/8 Watt 1% Resistor 4.7K Ohm 1/8 Watt 1% Resistor 5.1K Ohm 1/8 Watt 1% Resistor 5.6K Ohm 1/8 Watt 1% Resistor 10.0K Ohm 1/8 Watt 1% Resistor 22.0K Ohm 1/8 Watt 1% Resistor 33.0K Ohm 1/8 Watt 1% Resistor 100K Ohm 1/8 Watt 1% Resistor 1206 - 1206 Surface Mount Package; DPN: 311-5.60CRCT-ND; MPN: RC0805FR-075R6L
R2-R4 R17 = microbuilder:RESISTOR: Resistors 0402 - 0402 Surface Mount Package 10.0K 1% 1/16W [Digikey: 311-10.0KLRTR-ND] 0603 - 0603 Surface Mount Package 0 Ohm 1/10 Watt 1% Resistor 15 Ohm 1/10 Watt 1% Resistor 33 Ohm 1/10 Watt 1% Resistor 49.9 Ohm 1/10 Watt 1% Resistor 100 Ohm 1/10 Watt 1% Resistor 150 Ohm 1/10 Watt 1% Resistor 240 Ohm 1/10 Watt 1% Resistor 390 Ohm 1/10 Watt 1% Resistor 560 Ohm 1/10 Watt 1% Resistor 750 Ohm 1/10 Watt 1% Resistor 1.0K Ohm 1/10 Watt 1% Resistor 1.5K Ohm 1/10 Watt 1% Resistor 2.0K Ohm 1/10 Watt 1% Resistor 4.7K Ohm 1/10 Watt 1% Resistor 10.0K Ohm 1/10 Watt 1% Resistor 20.0K Ohm 1/10 Watt 1% Resistor 33.0K Ohm 1/10 Watt 1% Resistor 100.0K Ohm 1/10 Watt 1% Resistor 0805 - 0805 Surface Mount Package 0 Ohm 1/8 Watt 1% Resistor 33 Ohm 1/8 Watt 1% Resistor 100 Ohm 1/8 Watt 1% Resistor 150 Ohm 1/8 Watt 1% Resistor 200 Ohm 1/8 Watt 1% Resistor 240 Ohm 1/8 Watt 1% Resistor 330 Ohm 1/8 Watt 1% Resistor 390 Ohm 1/8 Watt 1% Resistor 470 Ohm 1/8 Watt 1% Resistor 1.0K Ohm 1/8 Watt 1% Resistor 1.5K Ohm 1/8 Watt 1% Resistor 2.0K Ohm 1/8 Watt 1% Resistor 4.7K Ohm 1/8 Watt 1% Resistor 5.1K Ohm 1/8 Watt 1% Resistor 5.6K Ohm 1/8 Watt 1% Resistor 10.0K Ohm 1/8 Watt 1% Resistor 22.0K Ohm 1/8 Watt 1% Resistor 33.0K Ohm 1/8 Watt 1% Resistor 100K Ohm 1/8 Watt 1% Resistor 1206 - 1206 Surface Mount Package; DPN: 311-68.0CRCT-ND; MPN: RC0805FR-0768RL
R5-R7 = microbuilder:RESISTOR: Resistors 0402 - 0402 Surface Mount Package 10.0K 1% 1/16W [Digikey: 311-10.0KLRTR-ND] 0603 - 0603 Surface Mount Package 0 Ohm 1/10 Watt 1% Resistor 15 Ohm 1/10 Watt 1% Resistor 33 Ohm 1/10 Watt 1% Resistor 49.9 Ohm 1/10 Watt 1% Resistor 100 Ohm 1/10 Watt 1% Resistor 150 Ohm 1/10 Watt 1% Resistor 240 Ohm 1/10 Watt 1% Resistor 390 Ohm 1/10 Watt 1% Resistor 560 Ohm 1/10 Watt 1% Resistor 750 Ohm 1/10 Watt 1% Resistor 1.0K Ohm 1/10 Watt 1% Resistor 1.5K Ohm 1/10 Watt 1% Resistor 2.0K Ohm 1/10 Watt 1% Resistor 4.7K Ohm 1/10 Watt 1% Resistor 10.0K Ohm 1/10 Watt 1% Resistor 20.0K Ohm 1/10 Watt 1% Resistor 33.0K Ohm 1/10 Watt 1% Resistor 100.0K Ohm 1/10 Watt 1% Resistor 0805 - 0805 Surface Mount Package 0 Ohm 1/8 Watt 1% Resistor 33 Ohm 1/8 Watt 1% Resistor 100 Ohm 1/8 Watt 1% Resistor 150 Ohm 1/8 Watt 1% Resistor 200 Ohm 1/8 Watt 1% Resistor 240 Ohm 1/8 Watt 1% Resistor 330 Ohm 1/8 Watt 1% Resistor 390 Ohm 1/8 Watt 1% Resistor 470 Ohm 1/8 Watt 1% Resistor 1.0K Ohm 1/8 Watt 1% Resistor 1.5K Ohm 1/8 Watt 1% Resistor 2.0K Ohm 1/8 Watt 1% Resistor 4.7K Ohm 1/8 Watt 1% Resistor 5.1K Ohm 1/8 Watt 1% Resistor 5.6K Ohm 1/8 Watt 1% Resistor 10.0K Ohm 1/8 Watt 1% Resistor 22.0K Ohm 1/8 Watt 1% Resistor 33.0K Ohm 1/8 Watt 1% Resistor 100K Ohm 1/8 Watt 1% Resistor 1206 - 1206 Surface Mount Package; DPN: 311-27ARCT-ND; MPN: RC0805JR-0727RL
R8-R13 = microbuilder:RESISTOR: Resistors 0402 - 0402 Surface Mount Package 10.0K 1% 1/16W [Digikey: 311-10.0KLRTR-ND] 0603 - 0603 Surface Mount Package 0 Ohm 1/10 Watt 1% Resistor 15 Ohm 1/10 Watt 1% Resistor 33 Ohm 1/10 Watt 1% Resistor 49.9 Ohm 1/10 Watt 1% Resistor 100 Ohm 1/10 Watt 1% Resistor 150 Ohm 1/10 Watt 1% Resistor 240 Ohm 1/10 Watt 1% Resistor 390 Ohm 1/10 Watt 1% Resistor 560 Ohm 1/10 Watt 1% Resistor 750 Ohm 1/10 Watt 1% Resistor 1.0K Ohm 1/10 Watt 1% Resistor 1.5K Ohm 1/10 Watt 1% Resistor 2.0K Ohm 1/10 Watt 1% Resistor 4.7K Ohm 1/10 Watt 1% Resistor 10.0K Ohm 1/10 Watt 1% Resistor 20.0K Ohm 1/10 Watt 1% Resistor 33.0K Ohm 1/10 Watt 1% Resistor 100.0K Ohm 1/10 Watt 1% Resistor 0805 - 0805 Surface Mount Package 0 Ohm 1/8 Watt 1% Resistor 33 Ohm 1/8 Watt 1% Resistor 100 Ohm 1/8 Watt 1% Resistor 150 Ohm 1/8 Watt 1% Resistor 200 Ohm 1/8 Watt 1% Resistor 240 Ohm 1/8 Watt 1% Resistor 330 Ohm 1/8 Watt 1% Resistor 390 Ohm 1/8 Watt 1% Resistor 470 Ohm 1/8 Watt 1% Resistor 1.0K Ohm 1/8 Watt 1% Resistor 1.5K Ohm 1/8 Watt 1% Resistor 2.0K Ohm 1/8 Watt 1% Resistor 4.7K Ohm 1/8 Watt 1% Resistor 5.1K Ohm 1/8 Watt 1% Resistor 5.6K Ohm 1/8 Watt 1% Resistor 10.0K Ohm 1/8 Watt 1% Resistor 22.0K Ohm 1/8 Watt 1% Resistor 33.0K Ohm 1/8 Watt 1% Resistor 100K Ohm 1/8 Watt 1% Resistor 1206 - 1206 Surface Mount Package; DPN: 311-10.0KCRCT-ND; MPN: RC0805FR-0710KL
R14-R16 = microbuilder:RESISTOR: Resistors 0402 - 0402 Surface Mount Package 10.0K 1% 1/16W [Digikey: 311-10.0KLRTR-ND] 0603 - 0603 Surface Mount Package 0 Ohm 1/10 Watt 1% Resistor 15 Ohm 1/10 Watt 1% Resistor 33 Ohm 1/10 Watt 1% Resistor 49.9 Ohm 1/10 Watt 1% Resistor 100 Ohm 1/10 Watt 1% Resistor 150 Ohm 1/10 Watt 1% Resistor 240 Ohm 1/10 Watt 1% Resistor 390 Ohm 1/10 Watt 1% Resistor 560 Ohm 1/10 Watt 1% Resistor 750 Ohm 1/10 Watt 1% Resistor 1.0K Ohm 1/10 Watt 1% Resistor 1.5K Ohm 1/10 Watt 1% Resistor 2.0K Ohm 1/10 Watt 1% Resistor 4.7K Ohm 1/10 Watt 1% Resistor 10.0K Ohm 1/10 Watt 1% Resistor 20.0K Ohm 1/10 Watt 1% Resistor 33.0K Ohm 1/10 Watt 1% Resistor 100.0K Ohm 1/10 Watt 1% Resistor 0805 - 0805 Surface Mount Package 0 Ohm 1/8 Watt 1% Resistor 33 Ohm 1/8 Watt 1% Resistor 100 Ohm 1/8 Watt 1% Resistor 150 Ohm 1/8 Watt 1% Resistor 200 Ohm 1/8 Watt 1% Resistor 240 Ohm 1/8 Watt 1% Resistor 330 Ohm 1/8 Watt 1% Resistor 390 Ohm 1/8 Watt 1% Resistor 470 Ohm 1/8 Watt 1% Resistor 1.0K Ohm 1/8 Watt 1% Resistor 1.5K Ohm 1/8 Watt 1% Resistor 2.0K Ohm 1/8 Watt 1% Resistor 4.7K Ohm 1/8 Watt 1% Resistor 5.1K Ohm 1/8 Watt 1% Resistor 5.6K Ohm 1/8 Watt 1% Resistor 10.0K Ohm 1/8 Watt 1% Resistor 22.0K Ohm 1/8 Watt 1% Resistor 33.0K Ohm 1/8 Watt 1% Resistor 100K Ohm 1/8 Watt 1% Resistor 1206 - 1206 Surface Mount Package; DPN: 311-1.00KCRCT-ND; MPN: RC0805FR-071KL
SJ1 = jumper:SJ2W: SMD solder JUMPER
TP2-TP5 = testpad:TP: Test pad
U1 = ik:RMLV0816BGSB-4S2#AA0; DPN: RMLV0816BGSB-4S2#AA0; MPN: RMLV0816BGSB-4S2#AA0
U2 = ultralibrarian:EP2C5T144I8; BUILT_BY: EMA_UL_Team; DPN: 544-2138-ND; MANUFACTURER_PART_NUMBER: EP2C5T144I8; MPN: EP2C5T144I8; SOURCELIBRARY: Altera_2008-01-01_1; VENDOR: Altera
U3 = microbuilder:FAN5331: FAN5331 - LED/OLED 20V Boost Converter Digikey: FAN5331SXCT-ND; DPN: FAN5333BSXCT-ND; MPN: FAN5333BSX
U4 = ik:NCP565ST12T3G; DPN: NCP565ST12T3GOSCT-ND; MPN: NCP565ST12T3G
U5 = ik:LP3965EMP-3.3/NOPB; DPN: LP3965EMP-3.3/NOPBCT-ND; MPN: LP3965EMP-3.3/NOPB
U6 = ik:EPCQ4ASI8N; DPN: 544-3442-ND; MPN: EPCQ4ASI8N

## Net classes
0 default: width 0.203 mm, drill 0.356 mm, clearance 0.203 mm

## Board
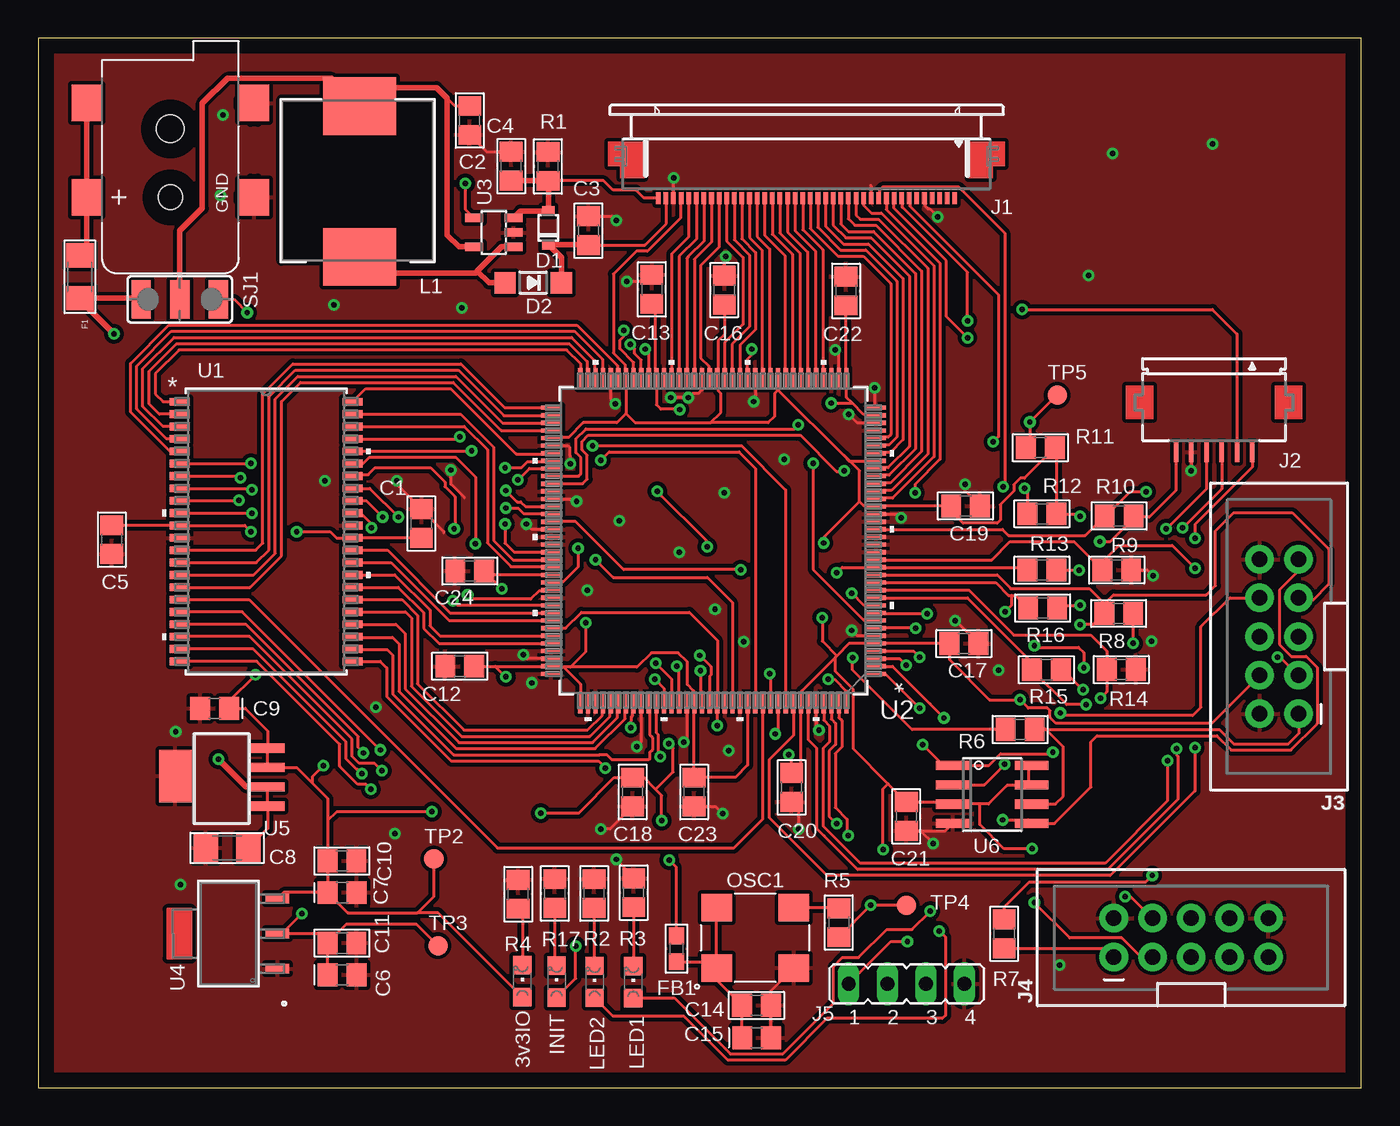
[diagram p2: board, top side]
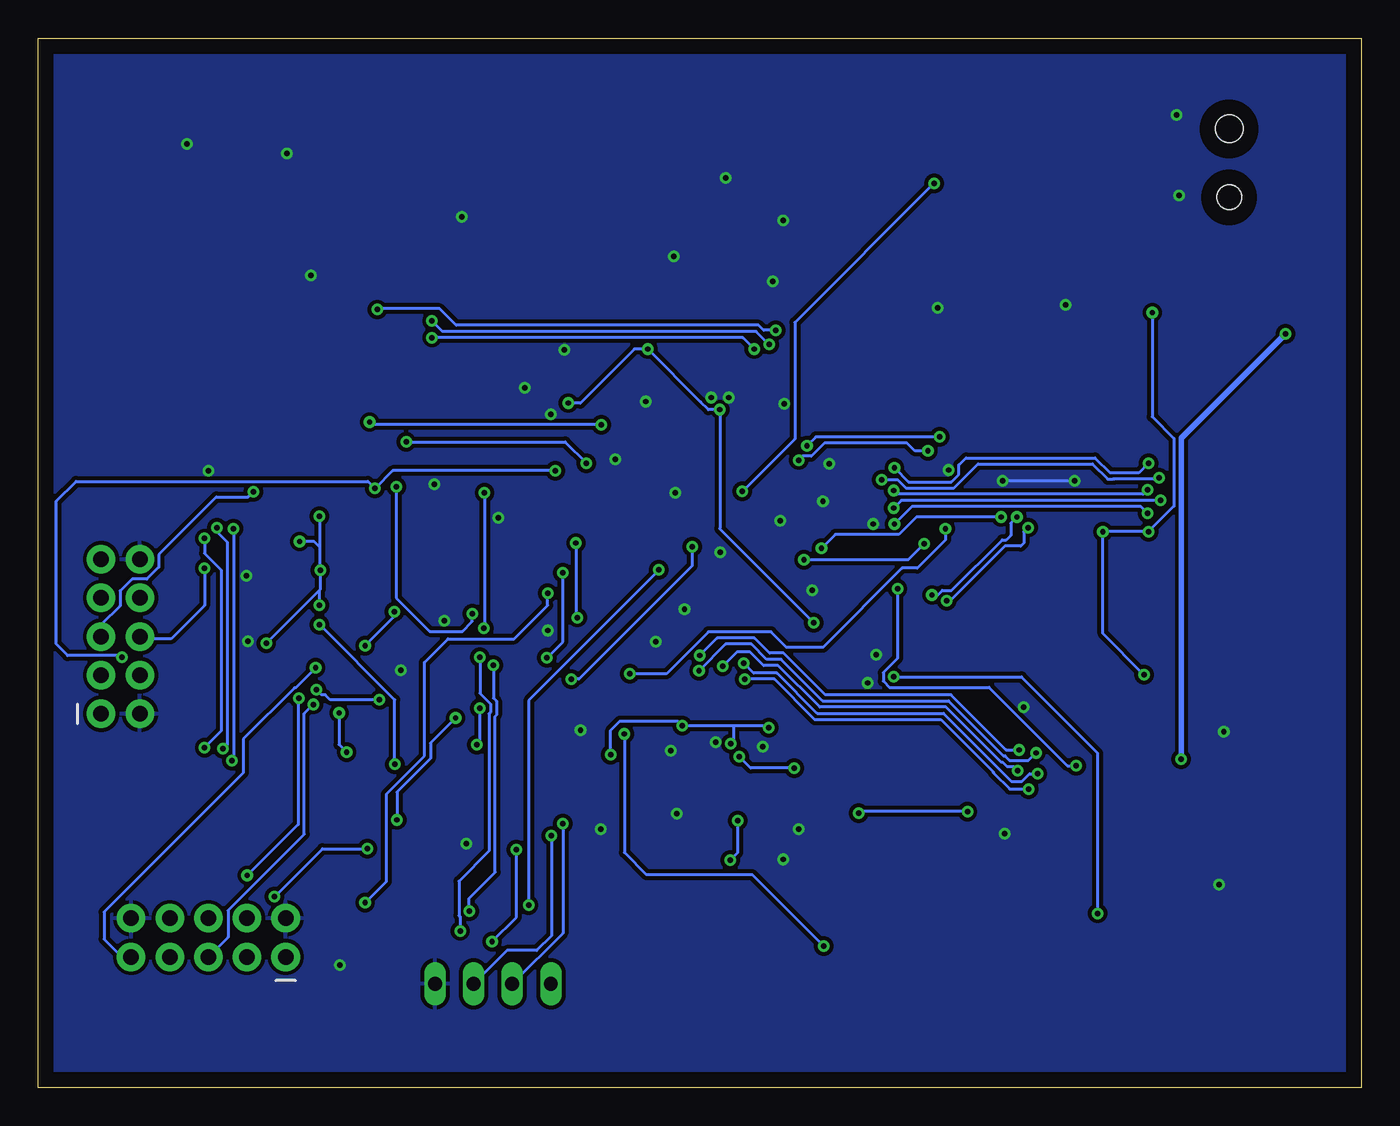
[diagram p3: board, bottom side, seen from below]

Size 87 x 69 mm. Coordinates in mm from the lower left corner, seen from the top.
Outline: 0,0 87,0 87,69 0,69 0,0
Copper layers (1*16): Top 0.035mm / dielectric 1.5mm / Bottom 0.035mm
Design rules "default *": minimum track width 5mil, minimum drill 0.2mm, track to track 7mil, track to pad 7mil, pad to pad 7mil, via to via 7mil, smd to smd 7mil, copper to edge 40mil, drill to drill 6mil, minimum pad ring 10mil, minimum via ring 8mil, stop-mask expansion 4mil, vias tented up to drill 0mil, thermal gap 10mil

### Footprints (pad centres in the part's own frame; a part is rotated, then mirrored left to right if it is on the bottom)
0805 = smd 1.3 x 1.5: 1 -0.95,0; 2 0.95,0
CPOL0805 = smd 1.3 x 1.5: 1 -0.95,0; 2 0.95,0
1206 = smd 1.6 x 1.8: 1 -1.4,0; 2 1.4,0
DCJACK_2MM_SMT = smd 2.4 x 2: GND 0,-5.5; GNDBREAK 6.2,-5.5; PWR1 0,5.5; PWR2 6.2,5.5 | hole 1.6: 0,0 | hole 1.8: 4.5,0
SOD-323 = smd 0.63 x 0.83: 1 -1.11,0; 2 1.11,0
SOD-123 = smd 1.4 x 1.4: A 1.85,0; C -1.85,0
0603 = smd 1.1 x 1: 1 -0.85,0; 2 0.85,0
54132-4097 = smd 0.3 x 0.8: 1 12.25,2.5; 2 11.75,2.5; 3 11.25,2.5; 4 10.75,2.5; 5 10.25,2.5; 6 9.75,2.5; 7 9.25,2.5; 8 8.75,2.5; 9 8.25,2.5; 10 7.75,2.5; 11 7.25,2.5; 12 6.75,2.5; 13 6.25,2.5; 14 5.75,2.5; 15 5.25,2.5; 16 4.75,2.5; 17 4.25,2.5; 18 3.75,2.5; 19 3.25,2.5; 20 2.75,2.5; 21 2.25,2.5; 22 1.75,2.5; 23 1.25,2.5; 24 0.75,2.5; 25 0.25,2.5; 26 -0.25,2.5; 27 -0.75,2.5; 28 -1.25,2.5; 29 -1.75,2.5; 30 -2.25,2.5; 31 -2.75,2.5; 32 -3.25,2.5; 33 -3.75,2.5; 34 -4.25,2.5; 35 -4.75,2.5; 36 -5.25,2.5; 37 -5.75,2.5; 38 -6.25,2.5; 39 -6.75,2.5; 40 -7.25,2.5
52271-0679 = smd 0.3 x 1.3: 1 1.5,3.25; 2 0.5,3.25; 3 -0.5,3.25; 4 -1.5,3.25; 5 -2.5,3.25; 6 -3.5,3.25
2X5-SHROUDED = drill 1.016 pad 1.88: 1 -1.27,5.08; 2 1.27,5.08; 3 -1.27,2.54; 4 1.27,2.54; 5 -1.27,0; 6 1.27,0; 7 -1.27,-2.54; 8 1.27,-2.54; 9 -1.27,-5.08; 10 1.27,-5.08
JP4 = drill 0.914 long: 1 -3.81,0; 2 -1.27,0; 3 1.27,0; 4 3.81,0
SPM10040T-100M-HZ = smd 3.8 x 4.8: 1 -4.95,0; 2 4.95,0
CHIPLED_0805 = smd 1.2 x 1.2: A 0,-1.05; C 0,1.05
CRYSTALASV = smd 2.007 x 1.803: 1 -2.54,-1.994; 2 2.54,-1.994; 3 2.54,1.994; 4 -2.54,1.994
SJ_2W = smd 1.27 x 2.54: 1 -2.54,0; 2 0,0; 3 2.54,0
B1,27 = smd 1.27 x 1.27: TP 0,0
PTSB0044GG-A_REN = smd 1.321 x 0.508: 1 -5.677,8.534; 2 -5.677,7.722; 3 -5.677,6.909; 4 -5.677,6.096; 5 -5.677,5.283; 6 -5.677,4.47; 7 -5.677,3.658; 8 -5.677,2.845; 9 -5.677,2.032; 10 -5.677,1.219; 11 -5.677,0.406; 12 -5.677,-0.406; 13 -5.677,-1.219; 14 -5.677,-2.032; 15 -5.677,-2.845; 16 -5.677,-3.658; 17 -5.677,-4.47; 18 -5.677,-5.283; 19 -5.677,-6.096; 20 -5.677,-6.909; 21 -5.677,-7.722; 22 -5.677,-8.534; 23 5.677,-8.534; 24 5.677,-7.722; 25 5.677,-6.909; 26 5.677,-6.096; 27 5.677,-5.283; 28 5.677,-4.47; 29 5.677,-3.658; 30 5.677,-2.845; 31 5.677,-2.032; 32 5.677,-1.219; 33 5.677,-0.406; 34 5.677,0.406; 35 5.677,1.219; 36 5.677,2.032; 37 5.677,2.845; 38 5.677,3.658; 39 5.677,4.47; 40 5.677,5.283; 41 5.677,6.096; 42 5.677,6.909; 43 5.677,7.722; 44 5.677,8.534
144-TQFP_ALR = smd 1.353 x 0.279: 1 -10.672,8.75; 2 -10.672,8.25; 3 -10.672,7.75; 4 -10.672,7.25; 5 -10.672,6.75; 6 -10.672,6.25; 7 -10.672,5.75; 8 -10.672,5.25; 9 -10.672,4.75; 10 -10.672,4.25; 11 -10.672,3.75; 12 -10.672,3.25; 13 -10.672,2.75; 14 -10.672,2.25; 15 -10.672,1.75; 16 -10.672,1.25; 17 -10.672,0.75; 18 -10.672,0.25; 19 -10.672,-0.25; 20 -10.672,-0.75; 21 -10.672,-1.25; 22 -10.672,-1.75; 23 -10.672,-2.25; 24 -10.672,-2.75; 25 -10.672,-3.25; 26 -10.672,-3.75; 27 -10.672,-4.25; 28 -10.672,-4.75; 29 -10.672,-5.25; 30 -10.672,-5.75; 31 -10.672,-6.25; 32 -10.672,-6.75; 33 -10.672,-7.25; 34 -10.672,-7.75; 35 -10.672,-8.25; 36 -10.672,-8.75; 73 10.672,-8.75; 74 10.672,-8.25; 75 10.672,-7.75; 76 10.672,-7.25; 77 10.672,-6.75; 78 10.672,-6.25; 79 10.672,-5.75; 80 10.672,-5.25; 81 10.672,-4.75; 82 10.672,-4.25; 83 10.672,-3.75; 84 10.672,-3.25; 85 10.672,-2.75; 86 10.672,-2.25; 87 10.672,-1.75; 88 10.672,-1.25; 89 10.672,-0.75; 90 10.672,-0.25; 91 10.672,0.25; 92 10.672,0.75; 93 10.672,1.25; 94 10.672,1.75; 95 10.672,2.25; 96 10.672,2.75; 97 10.672,3.25; 98 10.672,3.75; 99 10.672,4.25; 100 10.672,4.75; 101 10.672,5.25; 102 10.672,5.75; 103 10.672,6.25; 104 10.672,6.75; 105 10.672,7.25; 106 10.672,7.75; 107 10.672,8.25; 108 10.672,8.75 | smd 0.279 x 1.353: 37 -8.75,-10.672; 38 -8.25,-10.672; 39 -7.75,-10.672; 40 -7.25,-10.672; 41 -6.75,-10.672; 42 -6.25,-10.672; 43 -5.75,-10.672; 44 -5.25,-10.672; 45 -4.75,-10.672; 46 -4.25,-10.672; 47 -3.75,-10.672; 48 -3.25,-10.672; 49 -2.75,-10.672; 50 -2.25,-10.672; 51 -1.75,-10.672; 52 -1.25,-10.672; 53 -0.75,-10.672; 54 -0.25,-10.672; 55 0.25,-10.672; 56 0.75,-10.672; 57 1.25,-10.672; 58 1.75,-10.672; 59 2.25,-10.672; 60 2.75,-10.672; 61 3.25,-10.672; 62 3.75,-10.672; 63 4.25,-10.672; 64 4.75,-10.672; 65 5.25,-10.672; 66 5.75,-10.672; 67 6.25,-10.672; 68 6.75,-10.672; 69 7.25,-10.672; 70 7.75,-10.672; 71 8.25,-10.672; 72 8.75,-10.672; 109 8.75,10.672; 110 8.25,10.672; 111 7.75,10.672; 112 7.25,10.672; 113 6.75,10.672; 114 6.25,10.672; 115 5.75,10.672; 116 5.25,10.672; 117 4.75,10.672; 118 4.25,10.672; 119 3.75,10.672; 120 3.25,10.672; 121 2.75,10.672; 122 2.25,10.672; 123 1.75,10.672; 124 1.25,10.672; 125 0.75,10.672; 126 0.25,10.672; 127 -0.25,10.672; 128 -0.75,10.672; 129 -1.25,10.672; 130 -1.75,10.672; 131 -2.25,10.672; 132 -2.75,10.672; 133 -3.25,10.672; 134 -3.75,10.672; 135 -4.25,10.672; 136 -4.75,10.672; 137 -5.25,10.672; 138 -5.75,10.672; 139 -6.25,10.672; 140 -6.75,10.672; 141 -7.25,10.672; 142 -7.75,10.672; 143 -8.25,10.672; 144 -8.75,10.672
SOT23-5@1 = smd 0.55 x 1.2: 1 -0.95,-1.3; 2 0,-1.3; 3 0.95,-1.3; 4 0.95,1.3; 5 -0.95,1.3
SOT223-3_ONS = smd 0.61 x 1.549: 1 -2.299,-3.226; 2 0,-3.226; 3 2.299,-3.226
NDC0005A = smd 2.2 x 0.6: 1 -3.15,2.25; 2 -3.15,0.98; 3 -3.15,-0.29; 4 -3.15,-1.56 | smd 2.15 x 3.45: 5 2.93,0.27
8SOIC = smd 0.6 x 2.2: 1 -1.505,-2.6; 2 -0.235,-2.6; 3 1.035,-2.6; 4 2.305,-2.6; 5 2.305,2.6; 6 1.035,2.6; 7 -0.235,2.6; 8 -1.505,2.6

### Placement (x,y rotation side)
C1  25.2,37.08 90 top
C2  28.38,63.58 270 top
C3  36.18,56.34 90 top
C4  31.1,60.58 90 top
C5  4.85,36.02 270 top
C6  19.99,7.42 0 top
C7  19.99,12.82 0 top
C8  12.43,15.75 180 top
C9  11.61,24.93 180 top
C10  19.98,14.9 0 top
C11  19.98,9.5 0 top
C12  27.72,27.7 180 top
C13  40.35,52.48 90 top
C14  47.23,5.4 0 top
C15  47.24,3.27 0 top
C16  45.11,52.42 90 top
C17  60.87,29.19 0 top
C18  39.09,19.43 270 top
C19  60.97,38.24 0 top
C20  49.54,19.73 270 top
C21  57.08,17.83 270 top
C22  53.12,52.37 90 top
C23  43.13,19.43 270 top
C24  28.38,33.96 180 top
CN1  8.7,58.53 90 top
D1  33.55,56.52 90 top
D2  32.55,52.91 180 top
F1  2.75,53.3 270 top
FB1  41.97,9.13 270 top
J1  53.02,60.98 180 top
J2  76.31,45.04 180 top
J3  81.58,29.65 180 top
J4  75.8,9.86 90 top
J5  57.1,6.82 0 top
L1  21.15,59.56 90 top
LED1  39.13,6.94 0 top
LED2  36.59,6.95 0 top
LED3  31.84,7 0 top
LED4  34.09,6.97 0 top
OSC1  47.15,9.85 0 top
R1  33.52,60.56 270 top
R2  36.56,12.76 270 top
R3  39.16,12.81 270 top
R4  31.56,12.71 270 top
R5  52.64,10.84 90 top
R6  64.56,23.54 180 top
R7  63.51,10.11 270 top
R8  71.04,31.17 0 top
R9  70.91,34.03 180 top
R10  71.07,37.58 0 top
R11  65.89,42.07 0 top
R12  65.99,37.72 0 top
R13  65.99,34.02 0 top
R14  71.21,27.48 180 top
R15  66.29,27.47 0 top
R16  66.04,31.52 0 top
R17  33.97,12.76 270 top
SJ1  9.32,51.82 0 top
TP2  26.02,15.02 0 top
TP3  26.29,9.32 0 top
TP4  57.08,11.97 0 top
TP5  67,45.52 0 top
U1  15,36.55 0 top
U2  44.4,35.95 180 top
U3  29.96,56.22 90 top
U4  12.52,10.12 90 top
U5  11.96,20.75 180 top
U6  62.73,19.67 270 top

### Tracks (layer width: path | path; a pad name or v marks a point on that pad's centre or on a via)
1.2DV  (via drill 0.36)
  Top 0.203: U2.35 55.02,44.26 54.27,44.26 53.52,45 | 53.52,45 53.15,45.37 U2.37 53.12,46.65 C22.1 | C23.1 43.13,20.5 | 43.13,20.5 43.13,25.26 U2.124 43.09,25.33 43.09,26.08 42.69,26.49 42.69,27.98 42.08,28.59 40.32,28.59 39.38,27.64 35,27.64 | 34.53,27.64 33.78,27.64 U2.107 C12.1 30.05,27.7 v30.75,27 | 34.53,27.64 35.65,26.53 U2.109 | U2.50 46.65,47.9 46.91,48.16 v46.91,48.55 | v52.15,45 53.52,45 | 35,27.64 34.53,27.64 | v36,30.55 36,28.64 35,27.64 | C13.1 40.59,51.28 40.59,46.68 U2.62 40.65,44.9 40.95,44.6 42.15,44.6 v42.17,44.57 | U2.131 46.65,21.2 45.85,20.4 43.23,20.4 43.13,20.5 | C11.1 18.41,10.12 16.02,10.12 | 16.02,10.12 U4.2 | C6.1 C11.1 | v17.35,11.45 16.02,10.12 | C11.1 20.28,10.75 24.86,10.75 TP3.TP
  Bottom 0.203: v52.15,45 51.35,45 47.8,48.55 v46.91,48.55 43.44,45.08 | v36,30.55 42.2,36.75 42.17,36.78 v42.17,44.57 42.93,44.57 43.44,45.08 | v30.75,27 22.35,27 17.35,22 v17.35,11.45 | 43.44,45.08
3V3IO  (via drill 0.36)
  Top 0.203: C16.1 45.11,49.51 44.71,49.1 44.71,46.68 U2.54 44.71,46.57 44.71,45.82 44.88,45.64 44.88,44.38 44.21,43.71 | U2.116 39.09,25.22 39.09,24.48 39,24.38 39,24.08 38.96,24.05 v38.96,23.65 | 52.99,41.54 48.69,45.84 48.69,46.58 U2.46 48.59,46.57 48.59,45.82 48.42,45.64 48.42,44.13 48,43.71 44.21,43.71 | 52.99,41.54 53.32,41.2 U2.29 | 54,38.52 54.27,38.26 55.02,38.26 U2.23 55.11,38.24 C19.1 60.02,37.89 60.8,37.11 63.06,37.11 63.25,37.3 63.25,38.33 64.14,39.22 64.14,39.64 64.57,40.07 64.84,40.07 R11.2 66.94,41.97 R12.2 68.33,37.72 v68.5,37.55 | 54,38.52 54,40.55 53.01,41.54 52.99,41.54 | 52.51,28.39 53.32,29.2 U2.5 55.08,29.19 C17.1 59.92,28.13 62.55,25.5 v64.55,25.5 65.1,24.95 66.35,24.95 66.52,24.78 66.52,24.35 66.92,23.95 77.15,23.95 J3.4 | 52.51,28.39 52.41,28.29 | 52.41,28.29 50.21,26.08 50.21,25.33 U2.138 50.14,25.27 50.14,21.28 C20.1 49.54,21.71 v49.36,21.89 | C1.1 U1.33 | U1.33 | C5.1 9.31,36.97 U1.11 13.59,36.96 v14,36.55 | U2.95 29.59,33.7 C24.1 v30.5,32.79 | U6.7 65.28,19.85 65.1,19.85 | 65.1,19.85 63.7,19.85 62.48,18.64 61.9,18.64 | 61.9,18.64 U6.3 59.98,18.78 C21.1 55.88,19.98 | U6.8 65.1,20.95 65.1,19.85 | v17,36.55 19.2,36.55 19.62,36.13 U1.33 | v14.29,27.14 12.56,25.41 C9.1 13.62,24.93 15.11,23.44 U5.4 U5.3 17.01,21.04 18.02,20.02 | 18.02,20.02 19.05,19 19.05,17.55 | 19.05,17.55 19.05,14.92 C10.1 C7.1 | C7.1 16.15,12.82 U4.3 | C7.1 20.36,11.5 24.95,11.5 | TP2.TP 26.02,12.57 24.95,11.5 | LED3.A 26.29,11.5 24.95,11.5 | SJ1.3 12.88,51.82 v13.75,50.95 | 38.65,44.31 38.05,43.71 35.84,43.71 34.88,42.75 33.78,42.75 U2.77 | 38.65,44.31 U2.66 38.59,46.68 38.59,47.53 37.83,48.3 37.83,53.48 39.33,54.98 40.06,54.98 42.23,57.15 42.23,58.44 J1.4
  Top 0.203: 38.65,44.31 39.25,43.71 44.21,43.71 | 54,38.52 51.64,36.16 v51.64,35.8 | v51.55,30.9 51.55,29.35 52.51,28.39 | v68.7,26.15 67.38,27.47 R15.2 | J2.1 74.81,39.26 73.05,37.5 72.1,37.5 | 72.1,37.5 R10.2 | v68.45,34 66.96,34 R13.2 | v69.8,35.9 70.5,35.9 72.1,37.5 | v72,29.2 R8.2 | 55.88,19.98 53.59,22.27 53.59,26.18 52.41,27.36 52.41,28.29 | FB1.1 41.97,14.48 v41.5,14.95 | v41,17.55 41,19.2 40.6,19.6 | 40.6,19.6 39.82,20.38 C18.1 37.88,20.38 35.55,18.05 v33.05,18.05 | J4.4 71.84,12.55 v71.45,12.55 | v65.35,15.7 63.5,15.7 61.9,17.3 61.9,18.64 | J5.1 56.07,9.6 v57.15,9.6 | v55.55,15.65 55.55,19.65 55.88,19.98 | v44.65,23.8 U2.127 44.65,29.4 42.81,31.24 35.72,31.24 34.68,30.2 U2.102 | 19.05,17.55 19.65,18.15 v25.9,18.15 | v18.75,21.15 18.02,20.43 18.02,20.02 | 40.6,19.6 41.75,20.75 41.75,22.32 v41.47,22.6 | R16.2 67.17,31.7 v68.5,31.7
  Bottom 0.203: v14.29,27.14 17,29.85 v17,36.55 v14,36.55 12.33,38.22 12.33,42.68 13.75,44.1 v13.75,50.95 | v51.64,35.8 51.64,30.99 v51.55,30.9 | v64.55,25.5 67.79,25.5 68.12,25.82 68.37,25.82 v68.7,26.15 | v68.5,37.55 68.5,35.55 | 68.5,35.55 68.5,34.05 v68.45,34 68.45,32.75 68.5,32.7 | 68.5,35.55 68.85,35.9 v69.8,35.9 | 68.5,32.7 v72,29.2 | v41.5,14.95 41,15.45 v41,17.55 | v71.45,12.55 68.31,15.7 v65.35,15.7 | v57.15,9.6 55.55,11.2 v55.55,15.65 | v49.36,21.89 49.36,23.49 48.75,24.1 44.95,24.1 v44.65,23.8 41.25,23.8 | v25.9,18.15 32.95,18.15 v33.05,18.05 | v18.75,21.15 19.32,21.15 24.48,26.31 31.03,26.31 31.44,26.72 31.44,27.28 30.5,28.22 v30.5,32.79 | 41.25,23.8 39.11,23.8 v38.96,23.65 | v68.5,31.7 68.5,32.7 | v41.47,22.6 41.25,22.82 41.25,23.8
_GCLK
  Top 0.203: OSC1.3 52.59,11.84 R5.2
ADDR_A0
  Top 0.203: U1.5 8.67,41.83 6.08,44.42 6.08,47.6 8.6,50.13 35.42,50.13 38.09,47.45 38.09,46.68 U2.67
ADDR_A1
  Top 0.203: U1.4 8.46,42.65 6.49,44.61 6.49,47.44 8.77,49.72 35.26,49.72 37.09,47.88 37.09,46.68 U2.69
ADDR_A2
  Top 0.203: U2.70 36.59,46.68 36.59,47.8 35.09,49.31 8.94,49.31 6.89,47.27 6.89,44.78 8.22,43.46 U1.3
ADDR_A3
  Top 0.203: U1.2 7.98,44.27 7.3,44.95 7.3,47.1 9.11,48.91 34.92,48.91 36.09,47.73 36.09,46.68 U2.71
ADDR_A4
  Top 0.203: U2.72 35.65,47.6 34.75,48.5 9.28,48.5 7.71,46.93 7.71,45.59 8.22,45.08 U1.1
ADDR_A5
  Top 0.203: U1.44 21.54,45.94 27.13,45.94 31.43,41.65 33.68,41.65 U2.79
ADDR_A6
  Top 0.203: U1.43 27.78,44.27 29.95,42.1 29.95,35.98 31.23,34.7 U2.93
ADDR_A7
  Top 0.203: U1.42 28.02,43.46 29.54,41.93 29.54,35.81 31.09,34.26 33.67,34.26 U2.94
ADDR_A8
  Top 0.203: U1.28 23.92,32.08 24.95,31.05 24.95,26.55 28,23.5 36.12,23.5 37.09,24.48 37.09,25.22 U2.112
ADDR_A9
  Top 0.203: U1.27 24.16,31.27 24.54,30.88 24.54,26.38 27.83,23.09 36.29,23.09 37.59,24.4 37.59,25.22 U2.113
ADDR_A10
  Top 0.203: U1.26 23.53,30.45 24.14,29.85 24.14,26.21 27.66,22.69 36.46,22.69 38.09,24.33 38.09,25.22 U2.114
ADDR_A11
  Top 0.203: U1.25 20.72,29.6 23.3,29.6 23.73,29.17 23.73,26.05 27.5,22.28 36.62,22.28 38.59,24.25 38.59,25.22 U2.115
ADDR_A12
  Top 0.203: U1.24 20.7,28.8 22.95,28.8 23.32,28.43 23.32,25.88 27.33,21.87 36.9,21.87 37.4,21.87 37.72,21.55 40.15,21.55 40.21,21.61 40.21,22.03 40.38,22.2 40.38,23.02 40.21,23.19 40.21,24.48 40.21,25.12 40.1,25.23 U2.118
ADDR_A13  (via drill 0.36)
  Top 0.203: v37.3,21 36.83,21.47 27.16,21.47 22.92,25.71 22.92,27.6 22.5,28.02 U1.23 | U2.119 40.65,23.32 40.79,23.18 40.79,21.86 v40.9,21.75
  Bottom 0.203: v37.3,21 40.15,21 v40.9,21.75
ADDR_A14  (via drill 0.36)
  Top 0.203: v40.55,26.85 41.15,26.25 U2.120 | v21.87,19.62 21.55,19.94 21.02,19.94 19.83,21.13 19.83,22.57 14.38,28.02 U1.22
  Bottom 0.203: v40.55,26.85 38.6,26.85 35.95,24.2 27.65,24.2 24.2,20.75 24.2,20.7 23.12,19.62 v21.87,19.62
ADDR_A15  (via drill 0.36)
  Top 0.203: v40.6,27.9 41.65,26.85 U2.121 | v21.3,20.63 21.02,20.91 20.95,20.91 20.24,21.62 20.24,22.74 14.15,28.83 U1.21
  Bottom 0.203: v40.6,27.9 39.96,27.26 38.43,27.26 35.78,24.61 27.48,24.61 23.02,20.14 22.32,20.14 21.83,20.63 v21.3,20.63
ADDR_A16  (via drill 0.36)
  Top 0.203: U2.122 42.09,25.33 42.09,27.61 v42,27.7 | v22.6,20.83 22.11,21.31 21.12,21.31 20.64,21.79 20.64,22.91 13.91,29.64 U1.20
  Bottom 0.203: v42,27.7 41.05,28.65 40.2,28.65 39.3,27.75 38.35,27.75 35.61,25.01 27.31,25.01 23.7,21.4 23.6,21.4 23.31,21.11 22.88,21.11 v22.6,20.83
ADDR_A17  (via drill 0.36)
  Top 0.203: v43.55,27.4 43.55,26.14 43.61,26.07 43.61,25.32 U2.125 | v21.4,22 21.05,22.35 21.05,23.07 13.67,30.45 U1.19
  Bottom 0.203: v43.55,27.4 41.8,29.15 40.1,29.15 39.11,28.16 38.16,28.16 35.42,25.42 27.14,25.42 23.53,21.81 23.43,21.81 23.14,21.51 21.89,21.51 v21.4,22
ADDR_A18  (via drill 0.36)
  Top 0.203: U2.126 44.15,27.03 44.24,27.12 44.24,27.68 v43.51,28.41 | v22.5,22.2 13.43,31.27 U1.18
  Bottom 0.203: v43.51,28.41 42.36,29.56 39.91,29.56 38.91,28.56 37.99,28.56 35.25,25.83 26.98,25.83 23.36,22.21 22.51,22.21 v22.5,22.2
ASDO  (via drill 0.36)
  Top 0.203: v59.55,24.3 58.64,25.21 58.64,25.23 56.17,27.7 U2.2 | v63.4,17.6 65.09,17.6 U6.5 66.81,17.36 69.21,19.76 69.21,22.73 69.61,23.13 77.49,23.13 78.43,22.19 82.37,22.19 84.09,23.92 84.09,27.63 83.37,28.36 82.39,28.36 81.61,29.13 81.61,32.71 82.85,33.95 J3.9
  Bottom 0.203: v59.55,24.3 61.19,22.66 61.19,21.64 63.4,19.43 v63.4,17.6
B0
  Top 0.203: J1.21 50.77,56.48 52.6,54.65 54.25,54.65 56.05,52.85 56.05,42.93 55.87,42.76 55.13,42.76 U2.32
B1
  Top 0.203: J1.22 51.27,56.55 52.77,55.06 54.42,55.06 56.46,53.02 56.46,42.77 55.95,42.26 55.13,42.26 U2.31
B2
  Top 0.203: J1.23 51.77,56.63 52.93,55.46 54.59,55.46 56.87,53.18 56.87,42.6 56.02,41.76 55.13,41.76 U2.30
B3
  Top 0.203: J1.24 52.27,56.7 53.1,55.87 54.76,55.87 57.27,53.35 57.27,42.15 55.87,40.76 55.13,40.76 U2.28
B4
  Top 0.203: J1.25 52.77,56.78 53.27,56.28 54.92,56.28 57.68,53.52 57.68,41.98 55.95,40.26 55.13,40.26 U2.27
B5
  Top 0.203: J1.26 53.27,57.11 53.7,56.68 55.09,56.68 58.09,53.69 58.09,41.82 56.02,39.76 55.13,39.76 U2.26
B6
  Top 0.203: J1.27 53.77,57.37 54.05,57.09 55.26,57.09 58.49,53.86 58.49,41.65 56.1,39.26 55.13,39.26 U2.25
B7
  Top 0.203: J1.28 54.27,58 54.77,57.49 55.43,57.49 58.9,54.02 58.9,41.48 56.17,38.76 55.13,38.76 U2.24
CE_N  (via drill 0.36)
  Top 0.203: U2.16 62.7,34.7 63.89,35.89 68.1,35.89 R9.2 69.96,34.56 71.05,35.65 74.55,35.65 v76.05,34.15
  Bottom 0.203: v76.05,34.15 76.05,31.7 78.25,29.5 80.16,29.5 J3.6
CONF_DONE  (via drill 0.36)
  Top 0.203: U2.83 35.8,39.7 36.1,40 36.1,41.58 35.76,41.92 35.76,42.48 36.17,42.89 50.11,42.89 52.5,40.5 52.95,40.5 v53,40.55 | v64.85,39.39 65.04,39.2 R12.1 | J3.3 81.67,28.29 v81.48,28.29
  Bottom 0.203: v53,40.55 63.69,40.55 v64.85,39.39 65.31,39.85 84.5,39.85 85.8,38.55 85.8,29.15 85.05,28.4 81.6,28.4 v81.48,28.29
CONFIG_N  (via drill 0.36)
  Top 0.203: U2.20 63.4,36.7 63.8,36.3 68.84,36.3 R10.1 70.19,37.58 71.77,39.16 v72.85,39.16
  Bottom 0.203: J3.5 82.85,30.43 81.61,31.67 81.61,32.66 80.83,33.44 79.84,33.44 79.06,34.21 79.06,35.03 75.28,38.83 73.19,38.83 v72.85,39.16
CSO_N  (via drill 0.36)
  Top 0.203: v58.15,22.55 59.52,21.18 U6.1 62.51,21.18 63.27,21.94 66.6,21.94 v66.71,22.05 | v57.95,24.95 55.7,27.2 U2.1 | J3.8 78.35,32.2 76.45,30.3 76.45,25 75.9,24.45 67.39,24.45 v67.21,24.63
  Bottom 0.203: v58.15,22.55 57.95,22.75 v57.95,24.95 | v67.21,24.63 67.21,22.54 v66.71,22.05
DATA0  (via drill 0.36)
  Top 0.203: U2.14 63.05,33.7 63.95,32.8 69.1,32.8 70.09,31.81 R8.1 | R8.1 70.09,31.79 70.7,32.4 76.8,32.4 77.4,33 77.4,36.6 78.6,37.8 82.45,37.8 84.85,35.4 84.85,33.1 83.75,32 83.04,32 J3.7 | R8.1 69.36,30.44 v68.5,30.44 | v63.55,21.25 62.2,19.91 U6.2
  Bottom 0.203: v68.5,30.44 63.55,25.49 v63.55,21.25
DATA_IO0  (via drill 0.36)
  Top 0.203: U1.7 13.17,40.21 v13.3,40.08 | v31.55,39.95 32.3,40.7 U2.81
  Bottom 0.203: v13.3,40.08 13.38,40 16.25,40 16.35,40 16.69,40 17.68,40.99 25.21,40.99 26.79,39.41 29.94,39.41 30.47,39.94 31.54,39.94 v31.55,39.95
DATA_IO1  (via drill 0.36)
  Top 0.203: U1.8 13.96,39.4 v14.05,39.3 | v30.75,39.25 31.49,38.51 31.73,38.51 32.03,38.2 U2.86
  Bottom 0.203: v14.05,39.3 14.34,39.01 30.51,39.01 v30.75,39.25
DATA_IO2  (via drill 0.36)
  Top 0.203: U1.9 13.18,38.58 v13.2,38.6 | v30.75,38.1 31.56,38.1 31.91,37.76 33.67,37.76 U2.87
  Bottom 0.203: v13.2,38.6 30.25,38.6 v30.75,38.1
DATA_IO3  (via drill 0.36)
  Top 0.203: U1.10 14.03,37.77 v14.05,37.75 | v30.7,37.05 30.7,35.8 31.3,35.2 U2.92
  Bottom 0.203: v14.05,37.75 14.49,38.19 29.56,38.19 v30.7,37.05
DATA_IO4
  Top 0.203: U1.13 14.31,35.33 14.78,35.8 14.78,45.6 16.75,47.57 27.8,47.57 30.67,44.7 U2.73
DATA_IO5
  Top 0.203: U1.14 14.36,34.52 15.19,35.35 15.19,45.44 16.91,47.16 27.64,47.16 30.62,44.17 33.7,44.17 U2.74
DATA_IO6
  Top 0.203: U1.15 14.18,33.7 15.59,35.12 15.59,45.27 17.08,46.76 27.47,46.76 30.52,43.7 U2.75
DATA_IO7
  Top 0.203: U1.16 13.94,32.89 16,34.95 16,45.1 17.25,46.35 27.3,46.35 30.45,43.2 U2.76
DATA_IO8
  Top 0.203: U2.104 26.35,29.2 25.36,30.19 25.36,31.22 23.68,32.89 U1.29
DATA_IO9
  Top 0.203: U2.103 26.43,29.7 25.76,30.36 25.76,31.39 23.44,33.7 U1.30
DATA_IO10
  Top 0.203: U1.31 23.21,34.52 27.02,30.7 U2.101
DATA_IO11
  Top 0.203: U1.32 22.97,35.33 27.1,31.2 U2.100
DATA_IO12  (via drill 0.36)
  Top 0.203: U1.35 21.21,37.77 21.92,37.06 v21.92,36.82 | v27.27,32 27.57,31.7 U2.99
  Bottom 0.203: v21.92,36.82 22.2,36.54 22.2,35.8 22.4,35.6 23.45,35.6 27.16,31.89 v27.27,32
DATA_IO13  (via drill 0.36)
  Top 0.203: U1.36 21.58,38.58 v22.65,37.51 | U2.97 33.67,32.64 32.93,32.64 32.39,32.11 28.52,32.11 v28.24,32.39
  Bottom 0.203: v22.65,37.51 23.05,37.11 23.05,36.3 23.34,36.01 23.62,36.01 26.94,32.68 27.56,32.68 27.85,32.39 v28.24,32.39
DATA_IO14  (via drill 0.36)
  Top 0.203: U1.37 21.81,39.4 v23.7,37.51 | U2.96 33.77,33.24 34.51,33.24 35.5,34.22 v35.5,35.45
  Bottom 0.203: v23.7,37.51 29.27,37.51 30.42,36.36 34.59,36.36 v35.5,35.45
DATA_IO15  (via drill 0.36)
  Top 0.203: v27.35,36.75 27.4,36.8 27.4,38.85 26.74,39.51 26.74,39.81 25.8,40.75 22.15,40.75 21.7,40.3 20.77,40.3 U1.38 | v48.1,27.2 48.15,27.15 U2.134
  Bottom 0.203: v27.35,36.75 27.35,36 29.2,34.15 30.2,34.15 35.4,28.95 37.8,28.95 38.81,29.96 42.93,29.96 45.69,27.2 v48.1,27.2
DCLK
  Top 0.203: U6.6 66.89,18.64 67.4,19.15 67.4,22.4 66.25,23.55 R6.1 77.66,23.54 78.6,22.6 82.2,22.6 82.9,23.3 82.9,24.52 J3.1
DEN  (via drill 0.36)
  Top 0.203: J1.34 57.31,58.44 57.31,57.95 63.14,52.12 63.14,42.79 v62.8,42.45 | U2.8 55.02,30.76 54.27,30.76 50.95,34.07 v50.95,41.05
  Bottom 0.203: v62.8,42.45 52.35,42.45 v50.95,41.05
F_SW
  Top 0.356: U3.1 30.47,55.27 28.88,53.67 | 28.88,53.67 28.75,53.55 22.21,53.55 L1.1 | 28.88,53.67 29.64,52.91 D2.A
F_VIN
  Top 0.203: C2.1 27.42,64.53 26.9,65.05 | L1.2 19.3,66.36
  Top 0.356: L1.2 22.39,65.75 26.2,65.75 26.9,65.05 26.9,56.05 27.68,55.27 U3.5 | SJ1.2 9.32,56.33 10.79,57.8 10.79,64.7 12.45,66.36 19.3,66.36
G0
  Top 0.203: J1.13 46.77,55.88 47.59,55.05 47.59,46.68 U2.48
G1
  Top 0.203: J1.14 47.27,55.95 48.09,55.13 48.09,46.68 U2.47
G2
  Top 0.203: J1.15 47.77,56.03 49.09,54.7 49.09,46.68 U2.45
G3
  Top 0.203: J1.16 48.27,56.1 49.59,54.78 49.59,46.68 U2.44
G4
  Top 0.203: J1.17 48.77,56.18 50.09,54.85 50.09,46.68 U2.43
G5
  Top 0.203: J1.18 49.27,56.25 50.59,54.93 50.59,46.68 U2.42
G6
  Top 0.203: J1.19 49.77,56.33 51.09,55 51.09,46.68 U2.41
G7
  Top 0.203: J1.20 50.27,56.4 51.59,55.08 51.59,46.68 U2.40
GCLK  (via drill 0.36)
  Top 0.203: R5.1 v54.75,12 54.78,11.97 TP4.TP | v46.2,34.05 38.5,34.05 35.35,37.2 U2.88
  Bottom 0.203: v46.2,34.05 46.2,34 54.75,25.45 v54.75,12
GND  (via drill 0.36)
  Top 0.203: OSC1.2 48.18,6.35 C14.2 C15.2 | U6.4 59.65,16.88 C21.2 58.02,16.88 v58.85,16.05 | C2.2 29.48,61.53 C4.2 | R3.1 39.16,13.84 v38,15 | C18.2 37.61,17 v37,17 | C23.2 44.52,18.48 v45,18 | C20.2 50,18.32 v50,17 | J2.2 v75.81,40.55 v75.8,40.54 | C19.2 60.95,39.21 v60.95,39.65 | U2.22 56.5,37.7 v56.75,37.45 | U2.34 53.85,43.7 v53.3,44.26 | U2.36 55,44.77 v55,46 | U2.38 52.65,48.25 v52.4,48.5 | v41.6,45.36 v42.75,45.36 43.03,45.64 43.42,45.64 43.65,45.87 U2.56 | U2.68 37.65,45.24 v37.94,44.95 | C3.2 37.71,57.29 v38,57 | J1.3 41.77,59.77 v41.8,59.8 | C13.2 39.92,53 v38.7,53 | C16.2 45.11,54.56 v45.2,54.65 | J1.36 58.31,58.44 58.31,57.95 58.49,57.77 58.62,57.77 v59.15,57.25 | J1.29 54.77,59.28 54.75,59.3 | C17.2 60.32,30.69 v60.3,30.69 | U2.6 53.85,29.7 v53.5,30.05 | v27.15,40.6 27.15,39.67 28.04,38.79 | 26.66,36.47 26.66,36.57 C1.2 23.6,39.63 v23.6,39.9 | U2.106 32.15,28.2 v31.9,28.45 | U2.78 34.85,42.2 34.95,42.1 34.95,41.58 34.99,41.54 v34.99,41 | U2.85 35.25,38.7 v35.4,38.55 | U2.89 32.45,36.7 v32.1,37.05 | U2.117 39.65,22.7 v39.35,22.4 | U2.49 47.15,45.2 v47.05,45.1 | U2.140 51.15,23.69 v51.34,23.5 | U2.123 42.65,22.91 v42.44,22.7 | R9.1 72.92,34.03 v73.3,33.65
  Bottom 0.203: v27.15,40.6 27,40.75 | v23.6,39.9 v18.85,39.9
  other vias: 38.2,37.25 45.1,39.1 42.15,35.2 22.2,25 9.05,23.4 9.35,13.35 23.45,16.7 19.45,51.45 27.85,51.25 69.05,53.4 67.15,8.05 70.65,61.4 77.2,62.05 12,58.65 12.15,63.95 63.15,27.45 73.2,29.35 32.45,26.6 44.5,31.45 36.1,32.7 49.05,41.3 45.4,22.15 46.4,29.3
  pour Bottom (isolate 0.254): 0,0 0,69 87,69 87,0
  pour Top (isolate 0.254): 0,0 0,69 87,69 87,0
HSD  (via drill 0.36)
  Top 0.203: U2.63 40.15,48.45 40.05,48.55 v39.91,48.55 | v61.1,49.3 59.71,50.69 59.71,54.36 56.27,57.8 J1.32
  Bottom 0.203: v39.91,48.55 40.66,49.3 v61.1,49.3
INIT_DONE  (via drill 0.36)
  Top 0.203: U2.135 48.65,23.45 v48.45,23.25 | LED4.A 35.35,7.18 v35.35,9.3
  Bottom 0.203: v48.45,23.25 48.45,15.45 47,14 40.05,14 v35.35,9.3
INTN  (via drill 0.36)
  Top 0.203: v38.51,49.79 38.51,49.39 38.26,49.13 38.26,48.57 39.15,47.67 U2.65 | v64.7,51.15 77.2,51.15 78.81,49.54 J2.5
  Bottom 0.203: v38.51,49.79 39.3,49.79 39.63,50.11 59.51,50.11 60.6,51.2 64.65,51.2 v64.7,51.15
JTAG_TCK
  Top 0.203: R7.2 70.15,9.16 J4.1
JTAG_TDI  (via drill 0.36)
  Top 0.203: U2.13 62.96,33.2 63.8,32.35 64,32.35 | 64,32.35 64.25,32.35 R16.1 | 64,32.35 64,31.7 v63.59,31.29 | v65.5,29.05 65.6,28.95 68.4,28.95 68.75,28.6 v68.75,27.6
  Bottom 0.203: v63.59,31.29 63.59,30.96 v65.5,29.05 | v68.75,27.6 70.06,26.29 70.13,26.29 73.5,22.92 73.5,20.7 82.65,11.55 82.65,9.75 81.49,8.59 J4.9
JTAG_TDO  (via drill 0.36)
  Top 0.203: U2.10 54.3,31.7 v53.5,32.5 | J4.3 72.48,8.59 71.24,9.84 67.81,9.84 v65.5,12.15
  Bottom 0.203: v53.5,32.5 53.5,31.7 55.7,29.5 60.05,29.5 61.6,27.95 61.6,21.8 64.1,19.3 64.1,13.55 v65.5,12.15
JTAG_TMS  (via drill 0.36)
  Top 0.203: U2.11 61.1,32.2 65.34,27.96 R15.1 67.62,25.18 v68.9,25.18
  Bottom 0.203: J4.5 74.5,9.88 74.5,11.65 69.49,16.66 69.49,24.59 v68.9,25.18
LCDCLK  (via drill 0.36)
  Top 0.203: J1.30 55.31,58.52 55.31,59.01 55.49,59.19 60.55,59.19 63.55,56.18 63.55,39.6 v63.45,39.5 | v58.45,31.15 55.2,31.15 55.18,31.16 55.11,31.16 U2.9
  Bottom 0.203: v63.45,39.5 63.45,32.2 61.25,30 59.1,30 58.45,30.65 v58.45,31.15
LED+
  Top 0.203: C3.1 39.89,55.39 41.3,56.8 41.3,58.45 J1.2
  Top 0.356: D2.C 34.4,54.56 D1.1 36.16,55.41 C3.1
LED-
  Top 0.203: J1.1 39.82,58.48 39.3,59 37.8,59 37.19,59.61 R1.2
  Top 0.356: C4.1 31.12,59.61 R1.2 33.55,59.58 D1.2 31.72,57.63 U3.3
LIGHT  (via drill 0.36)
  Top 0.203: U3.4 28.1,57.73 v28.1,59.45 | v40.7,39.2 44,35.9 v44,35.55 | v51.95,26.85 52.35,26.85 53.15,26.05 U2.144
  Bottom 0.203: v28.1,59.45 37.25,50.3 37.25,42.65 v40.7,39.2 | v44,35.55 44,34.3 51.45,26.85 v51.95,26.85
N$1
  Top 0.356: CN1.PWR2 CN1.PWR1 3.2,55.15 F1.1
N$6
  Top 0.203: R4.2 31.84,11.48 LED3.C
N$7  (via drill 0.36)
  Top 0.203: R13.1 64.86,34.2 U2.15 52.85,34.2 v52.5,33.85 | R6.2 57.46,23.54 53.55,27.45 v53.55,28.25
  Bottom 0.203: v53.55,28.25 52.5,29.3 v52.5,33.85
N$9
  Top 0.203: R3.2 39.16,8.02 LED1.C
N$10  (via drill 0.36)
  Top 0.203: U2.12 61.2,32.7 64.15,29.75 69.2,29.75 70.26,28.69 R14.2 70.26,26.01 v69.85,25.6 | v73.25,13.95 72.8,13.5 65.15,13.5 63.51,11.86 R7.1
  Bottom 0.203: v69.85,25.6 69.9,25.55 69.9,17.3 v73.25,13.95
N$12
  Top 0.203: R17.2 33.97,8.14 LED4.C
N$13
  Top 0.203: R2.2 36.56,8.03 LED2.C
OSC_V
  Top 0.203: FB1.2 44.19,8.28 OSC1.1 | C15.1 C14.1 44.61,7.07 OSC1.1 | OSC1.1 OSC1.4
R0
  Top 0.203: J1.5 42.77,55.92 41.65,54.8 U2.60
R1
  Top 0.203: J1.6 43.27,55.77 42.15,54.65 U2.59
R2
  Top 0.203: J1.7 43.77,55.65 42.74,54.62 42.74,54.59 42.65,54.5 U2.58
R3
  Top 0.203: J1.8 44.27,55.57 43.15,54.45 U2.57
R4
  Top 0.203: J1.9 44.77,55.26 43.56,54.05 43.56,47.96 44.09,47.42 44.09,46.68 U2.55
R5
  Top 0.203: J1.10 45.27,55.66 46.36,54.57 46.36,50.18 45.14,48.96 45.14,46.63 U2.53
R6
  Top 0.203: J1.11 45.77,55.73 46.76,54.74 46.76,50.01 45.62,48.88 45.62,46.65 U2.52
R7
  Top 0.203: J1.12 46.27,55.8 47.17,54.91 47.17,49.84 46.15,48.83 U2.51
RSTN  (via drill 0.36)
  Top 0.203: J2.6 79.81,40.78 76.05,37.02 v76.05,36.1 | v76.05,22.35 76.05,19.5 70.49,13.94 51.87,13.94 48.06,17.75 48.06,21.56 49.65,23.15 U2.137
  Bottom 0.203: v76.05,36.1 76.05,35.12 74.96,34.03 74.96,23.44 v76.05,22.35
SCL  (via drill 0.36)
  Top 0.203: J2.3 76.81,39.36 74.2,36.75 v74.15,36.75 | v74.25,21.5 74.25,18.85 70.15,14.75 54.05,14.75 51.6,17.2 51.6,22.3 52.02,22.72 52.02,23.78 51.65,24.16 U2.141
  Bottom 0.203: v74.15,36.75 74.15,21.6 v74.25,21.5
SDA  (via drill 0.36)
  Top 0.203: J2.4 77.81,39.36 v75.25,36.8 | v74.84,22.28 74.84,21.88 74.94,21.78 74.94,18.96 70.32,14.34 53.88,14.34 51.67,16.55 51.65,16.55 51.19,17.01 51.19,22.31 50.65,22.85 U2.139
  Bottom 0.203: v75.25,36.8 75.25,36.55 74.56,35.86 74.56,22.56 v74.84,22.28
SRAM_CS_N  (via drill 0.36)
  Top 0.203: U1.6 13.97,41.02 v14,41.05 | v30.7,40.75 31.77,40.75 32.17,41.14 33.67,41.14 U2.80
  Bottom 0.203: v14,41.05 14.64,40.41 16.52,40.41 17.51,41.4 26,41.4 26.46,40.94 26.46,40.32 26.96,39.82 29.77,39.82 v30.7,40.75
SRAM_LB_N  (via drill 0.36)
  Top 0.203: v28.75,35.75 28.75,40.15 27.95,40.95 27.88,41.02 27.47,41.43 21.78,41.43 21.35,41 20.7,41 U1.39 | v36.65,34.7 37.8,33.55 44,33.55 45.65,31.9 U2.129
  Bottom 0.203: v28.75,35.75 29.8,34.7 v36.65,34.7
SRAM_OE_N  (via drill 0.36)
  Top 0.203: U1.41 27.61,42.65 v27.73,42.77 | v36.45,42.2 46.25,42.2 49.15,39.3 U2.136
  Bottom 0.203: v27.73,42.77 35.88,42.77 v36.45,42.2
SRAM_UB_N  (via drill 0.36)
  Top 0.203: U1.40 28.48,41.83 v28.5,41.85 | v37,41.25 37.54,41.79 46.08,41.79 47.16,40.71 47.16,25.29 U2.132
  Bottom 0.203: v28.5,41.85 29.35,41.85 29.87,42.37 35.31,42.37 36.17,41.51 36.74,41.51 v37,41.25
SRAM_WE_N
  Top 0.203: U1.17 13.87,32.08 30.2,15.75 45.75,15.75 47.65,17.65 U2.133
STATUS_N  (via drill 0.36)
  Top 0.203: U2.82 35.54,40.2 35.69,40.35 35.69,41.41 35.36,41.75 35.36,42.65 36.01,43.31 49.72,43.31 v49.98,43.57 | R11.1 65.2,42.33 v65.2,43.75 66.97,45.52 TP5.TP
  Bottom 0.203: v49.98,43.57 65.02,43.57 v65.2,43.75
STBYB  (via drill 0.36)
  Top 0.203: J1.31 55.77,57.73 59.3,54.19 59.3,41.31 57.65,39.66 v57.65,39.1 | v57.7,30.2 U2.7
  Bottom 0.203: v57.65,39.1 57.65,30.25 v57.7,30.2
UART_RX  (via drill 0.36)
  Top 0.203: v53.25,16.55 53.19,16.61 53.19,17.63 52.41,18.41 52.41,21.96 52.83,22.39 52.83,24.12 52.65,24.3 U2.143
  Bottom 0.203: v53.25,16.55 53.25,9.97 54.21,9.01 56.18,9.01 J5.3
UART_TX  (via drill 0.36)
  Top 0.203: U2.142 52.15,24.23 52.43,23.95 52.43,22.55 52.01,22.13 52.01,17.84 v52.5,17.35
  Bottom 0.203: v52.5,17.35 52.5,10.15 J5.2
USRLED1  (via drill 0.36)
  Top 0.203: U2.3 56.64,28.2 v57.07,27.77 | LED1.A 41.84,5.89 45.51,2.21 48.97,2.21 52.27,5.52 52.27,7.95 52.87,8.55 53.95,8.55 55.8,10.4 57.45,10.4 v58.65,11.6
  Bottom 0.203: v57.07,27.77 57.07,25.61 56.86,25.4 56.86,24.5 56.94,24.41 56.94,14.16 58.65,12.45 v58.65,11.6
USRLED2  (via drill 0.36)
  Top 0.203: U2.4 57.55,28.7 v57.95,28.3 | v59.25,10.3 59.65,9.9 59.65,4.75 59.45,4.55 51.88,4.55 49.13,1.81 45.34,1.81 42.45,4.7 37.79,4.7 LED2.A
  Bottom 0.203: v57.95,28.3 57.95,25.92 57.26,25.23 57.26,24.67 57.35,24.58 57.35,15.55 59.34,13.56 59.34,11.32 59.25,11.23 v59.25,10.3
VIN  (via drill 0.36)
  Top 0.203: U5.2 U5.1 15.11,17.03 C8.1
  Top 0.356: SJ1.1 6.7,51.9 F1.2 2.75,51.8 v5,49.55 | v11.85,21.6 13.68,19.77 U5.2
  Bottom 0.356: v5,49.55 11.85,42.7 v11.85,21.6
VSD  (via drill 0.36)
  Top 0.203: v38.94,48.85 39.22,48.57 39.22,48.27 39.65,47.84 U2.64 | v61.1,50.4 61.1,53.59 56.81,57.88 56.81,58.44 J1.33
  Bottom 0.203: v38.94,48.85 39.8,49.71 60.41,49.71 v61.1,50.4

### Text on the board
tPlace: INIT | 3v3IO